# Altium project MiCom.PrjPcb (part 2 of 6)

## Sheet AM3359_B.SchDoc
size A2
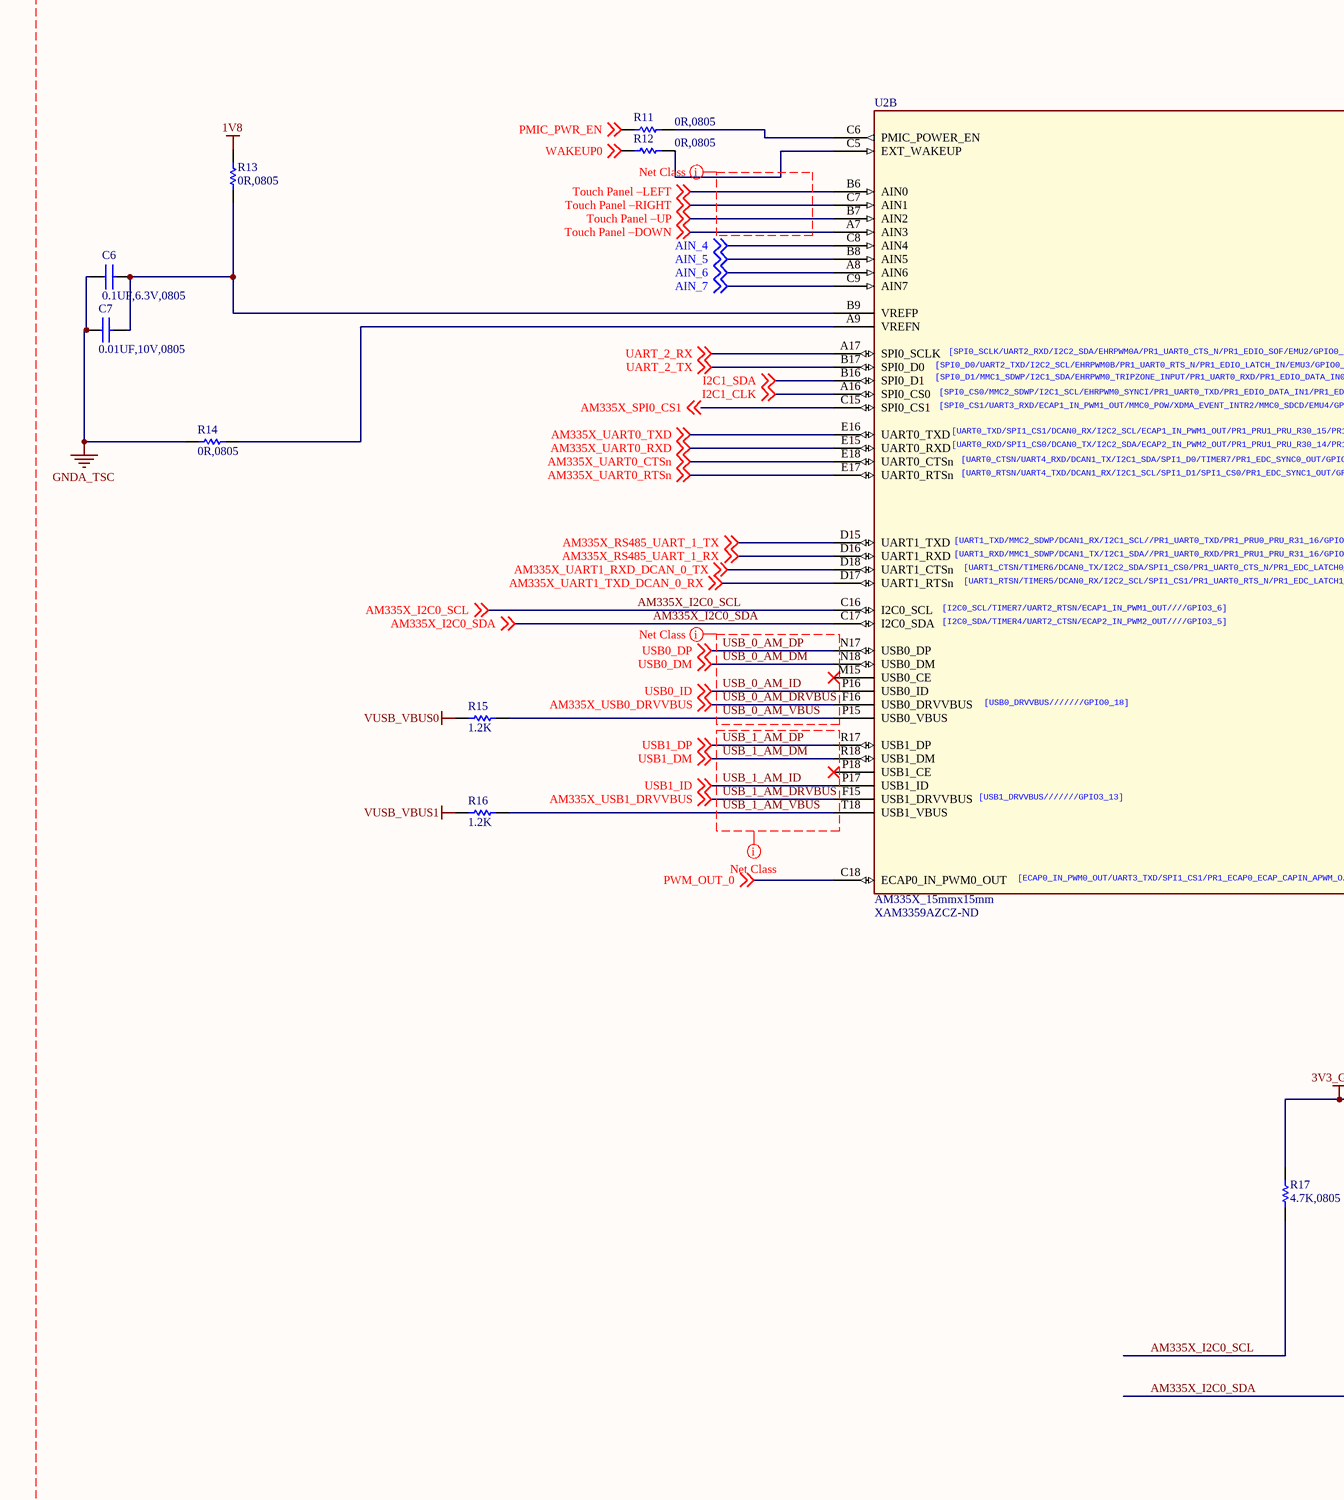
[diagram p2: AM3359_B.SchDoc, left]
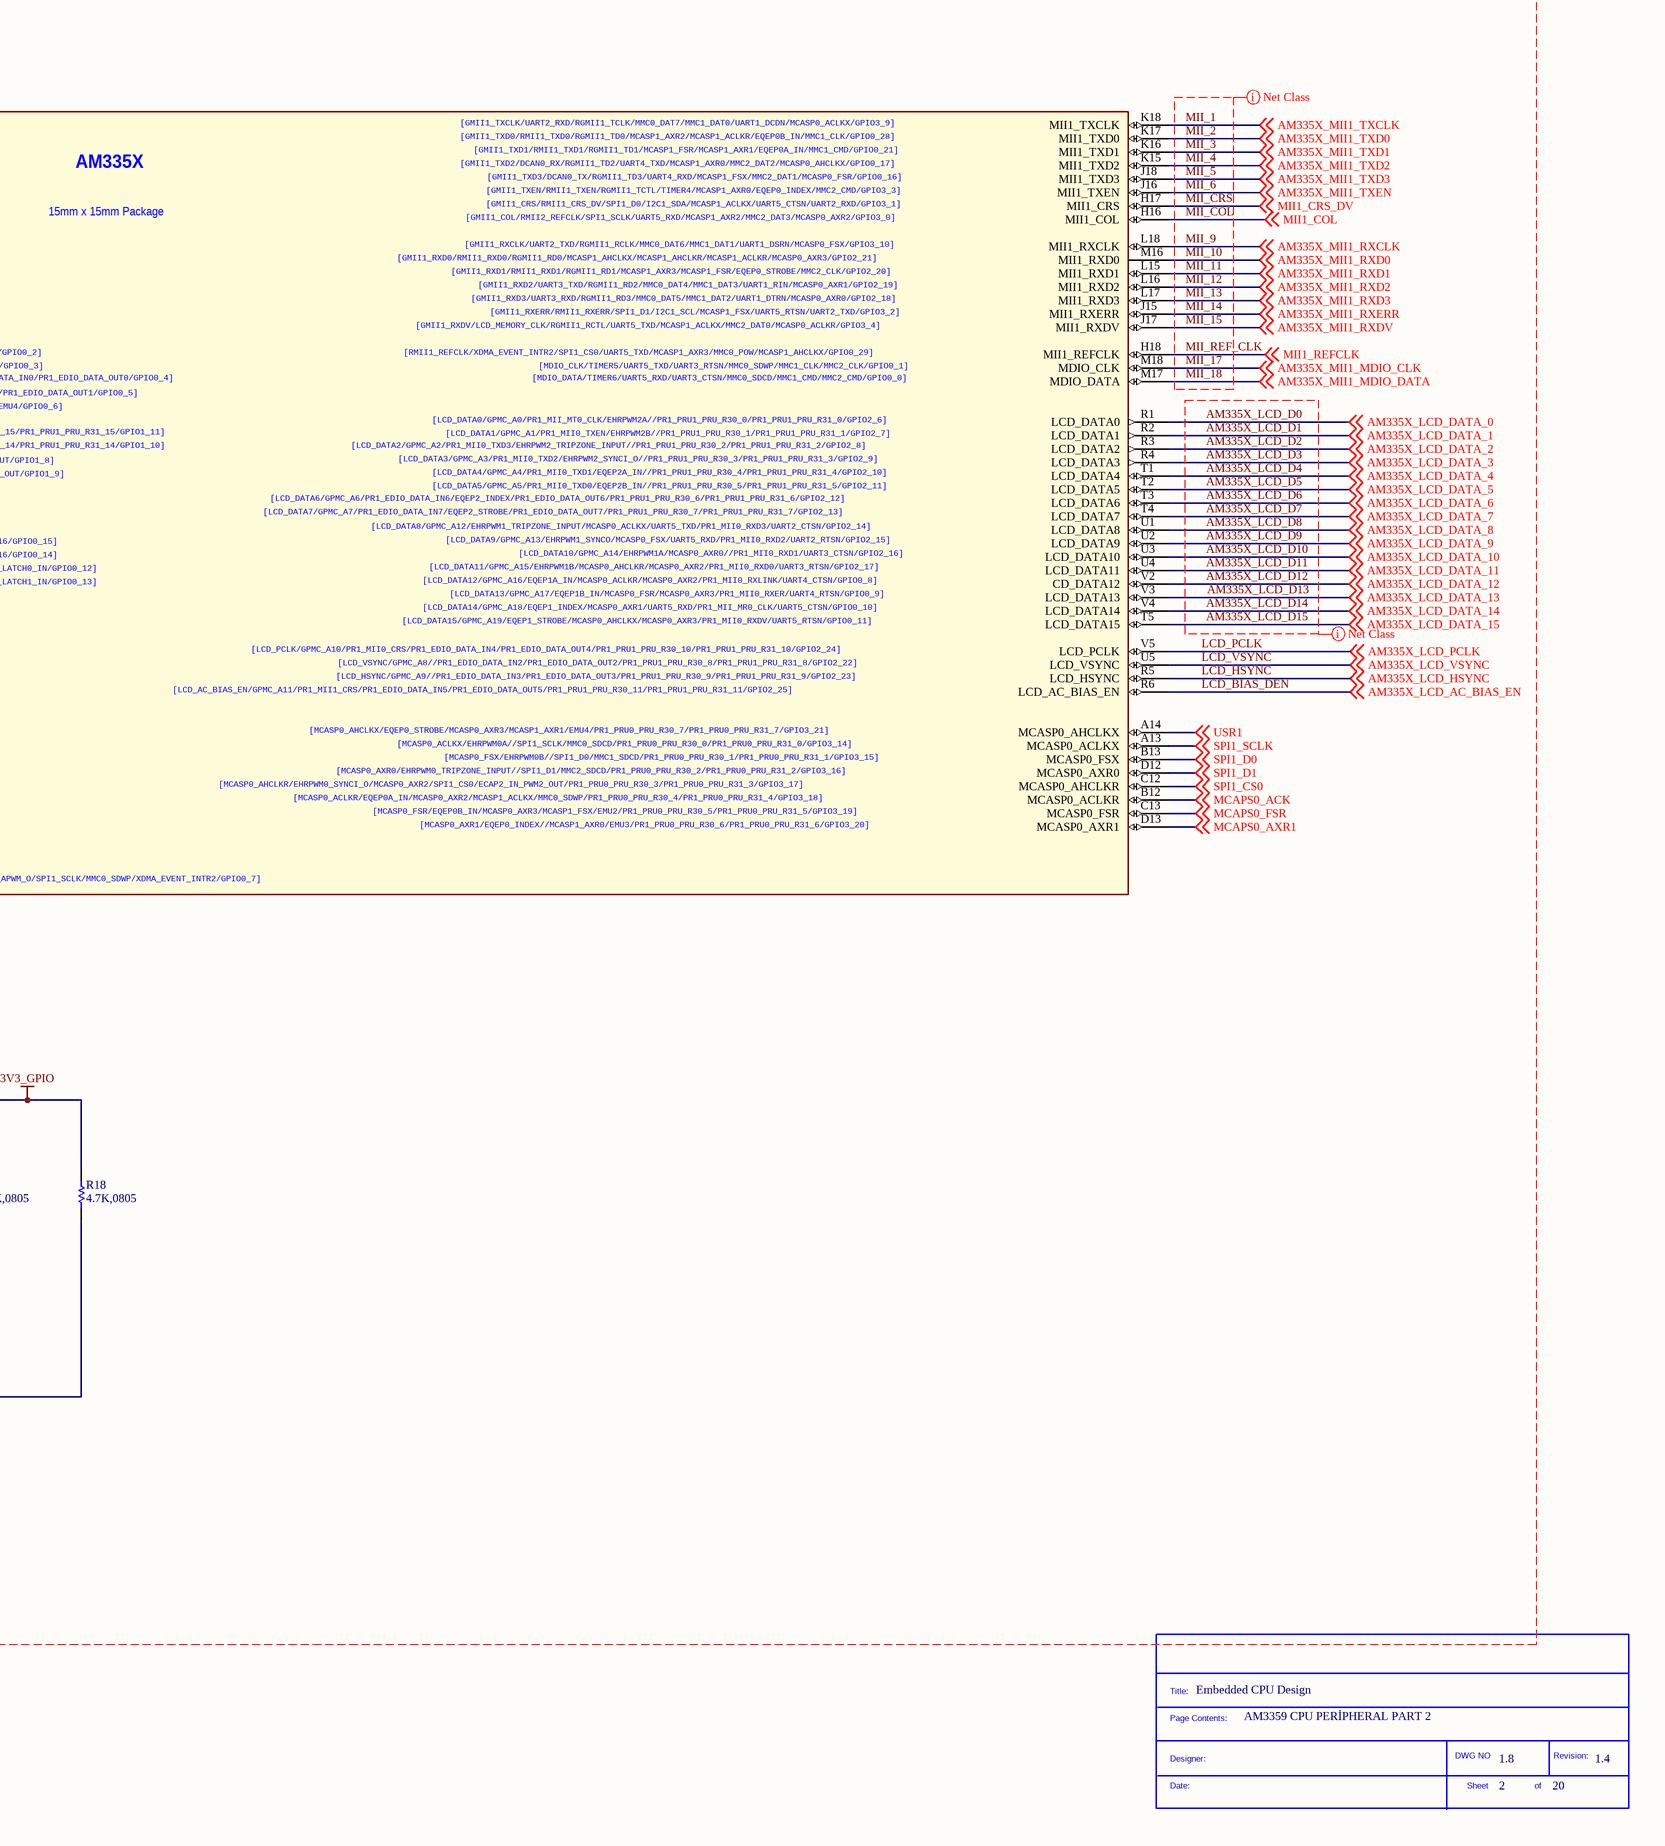
[diagram p3: AM3359_B.SchDoc, right]

### Parts
(Parts that share a designator on the sheet are numbered #1, #2 ... from top to bottom, then left to right.)
*?#2  SDTitleBlock  (value not drawn)  (graphical)
C6  0.1UF,6.3V,0805  [0402]
C7  0.01UF,10V,0805  [0402]
R11  0R,0805  [0402]
R12  0R,0805  [0402]
R13  0R,0805  [0402]
R14  0R,0805  [0402]
R15  1.2K  [0402]
R16  1.2K  [0402]
R17  4.7K,0805  [0402]
R18  4.7K,0805  [0402]
U2  AM335X_15mmx15mm  Supplier Part Number 1: XAM3359AZCZ-ND  [am33xx_15x15]  (part B of 3)

### Nets
1V8: R13.2  [project net 1V8_DM]
3V3_GPIO: R17.2 R18.2  [project net AM335X_VDDSHV1]
GNDA_TSC: C6.1 C7.1 R14.2  [project net GNDA_ADC]
VUSB_VBUS0: R15.1
VUSB_VBUS1: R16.1
AIN_4: U2.C8(AIN4) ; off-sheet AIN_4
AIN_5: U2.B8(AIN5) ; off-sheet AIN_5
AIN_6: U2.A8(AIN6) ; off-sheet AIN_6
AIN_7: U2.C9(AIN7) ; off-sheet AIN_7
AM335X_I2C0_SCL: R17.1 U2.C16(I2C0_SCL) ; off-sheet AM335X_I2C0_SCL
AM335X_I2C0_SDA: R18.1 U2.C17(I2C0_SDA) ; off-sheet AM335X_I2C0_SDA
AM335X_LCD_D0: U2.R1(LCD_DATA0) ; off-sheet AM335X_LCD_DATA_0  [also labelled AM335X_LCD_DATA_0]
AM335X_LCD_D1: U2.R2(LCD_DATA1) ; off-sheet AM335X_LCD_DATA_1  [also labelled AM335X_LCD_DATA_1]
AM335X_LCD_D2: U2.R3(LCD_DATA2) ; off-sheet AM335X_LCD_DATA_2  [also labelled AM335X_LCD_DATA_2]
AM335X_LCD_D3: U2.R4(LCD_DATA3) ; off-sheet AM335X_LCD_DATA_3  [also labelled AM335X_LCD_DATA_3]
AM335X_LCD_D4: U2.T1(LCD_DATA4) ; off-sheet AM335X_LCD_DATA_4  [also labelled AM335X_LCD_DATA_4]
AM335X_LCD_D5: U2.T2(LCD_DATA5) ; off-sheet AM335X_LCD_DATA_5  [also labelled AM335X_LCD_DATA_5]
AM335X_LCD_D6: U2.T3(LCD_DATA6) ; off-sheet AM335X_LCD_DATA_6  [also labelled AM335X_LCD_DATA_6]
AM335X_LCD_D7: U2.T4(LCD_DATA7) ; off-sheet AM335X_LCD_DATA_7  [also labelled AM335X_LCD_DATA_7]
AM335X_LCD_D8: U2.U1(LCD_DATA8) ; off-sheet AM335X_LCD_DATA_8  [also labelled AM335X_LCD_DATA_8]
AM335X_LCD_D9: U2.U2(LCD_DATA9) ; off-sheet AM335X_LCD_DATA_9  [also labelled AM335X_LCD_DATA_9]
AM335X_LCD_D10: U2.U3(LCD_DATA10) ; off-sheet AM335X_LCD_DATA_10  [also labelled AM335X_LCD_DATA_10]
AM335X_LCD_D11: U2.U4(LCD_DATA11) ; off-sheet AM335X_LCD_DATA_11  [also labelled AM335X_LCD_DATA_11]
AM335X_LCD_D12: U2.V2(CD_DATA12) ; off-sheet AM335X_LCD_DATA_12  [also labelled AM335X_LCD_DATA_12]
AM335X_LCD_D13: U2.V3(LCD_DATA13) ; off-sheet AM335X_LCD_DATA_13  [also labelled AM335X_LCD_DATA_13]
AM335X_LCD_D14: U2.V4(LCD_DATA14) ; off-sheet AM335X_LCD_DATA_14  [also labelled AM335X_LCD_DATA_14]
AM335X_LCD_D15: U2.T5(LCD_DATA15) ; off-sheet AM335X_LCD_DATA_15  [also labelled AM335X_LCD_DATA_15]
AM335X_RS485_UART_1_RX: U2.D16(UART1_RXD) ; off-sheet AM335X_RS485_UART_1_RX  [project net RS485_R]
AM335X_RS485_UART_1_TX: U2.D15(UART1_TXD) ; off-sheet AM335X_RS485_UART_1_TX  [project net RS485_D]
AM335X_SPI0_CS1: U2.C15(SPI0_CS1) ; off-sheet AM335X_SPI0_CS1  [project net MMC_CS0]
AM335X_UART0_CTSn: U2.E18(UART0_CTSn) ; off-sheet AM335X_UART0_CTSn
AM335X_UART0_RTSn: U2.E17(UART0_RTSn) ; off-sheet AM335X_UART0_RTSn
AM335X_UART0_RXD: U2.E15(UART0_RXD) ; off-sheet AM335X_UART0_RXD
AM335X_UART0_TXD: U2.E16(UART0_TXD) ; off-sheet AM335X_UART0_TXD
AM335X_UART1_RXD_DCAN_0_TX: U2.D18(UART1_CTSn) ; off-sheet AM335X_UART1_RXD_DCAN_0_TX  [project net CAN1_TXD]
AM335X_UART1_TXD_DCAN_0_RX: U2.D17(UART1_RTSn) ; off-sheet AM335X_UART1_TXD_DCAN_0_RX  [project net CAN1_RXD]
AM335X_USB0_DRVVBUS: U2.F16(USB0_DRVVBUS) ; off-sheet AM335X_USB0_DRVVBUS  [also labelled USB_0_AM_DRVBUS]  [project net USB0_VBUS_EN]
I2C1_CLK: U2.A16(SPI0_CS0) ; off-sheet I2C1_CLK
I2C1_SDA: U2.B16(SPI0_D1) ; off-sheet I2C1_SDA
LCD_BIAS_DEN: U2.R6(LCD_AC_BIAS_EN) ; off-sheet AM335X_LCD_AC_BIAS_EN  [also labelled AM335X_LCD_AC_BIAS_EN]
LCD_HSYNC: U2.R5(LCD_HSYNC) ; off-sheet AM335X_LCD_HSYNC  [also labelled AM335X_LCD_HSYNC]
LCD_PCLK: U2.V5(LCD_PCLK) ; off-sheet AM335X_LCD_PCLK  [also labelled AM335X_LCD_PCLK]
LCD_VSYNC: U2.U5(LCD_VSYNC) ; off-sheet AM335X_LCD_VSYNC  [also labelled AM335X_LCD_VSYNC]
MCAPS0_ACK: U2.B12(MCASP0_ACLKR) ; off-sheet MCAPS0_ACK
MCAPS0_AXR1: U2.D13(MCASP0_AXR1) ; off-sheet MCAPS0_AXR1
MCAPS0_FSR: U2.C13(MCASP0_FSR) ; off-sheet MCAPS0_FSR
MII_1: U2.K18(MII1_TXCLK) ; off-sheet AM335X_MII1_TXCLK  [also labelled AM335X_MII1_TXCLK]
MII_2: U2.K17(MII1_TXD0) ; off-sheet AM335X_MII1_TXD0  [also labelled AM335X_MII1_TXD0]
MII_3: U2.K16(MII1_TXD1) ; off-sheet AM335X_MII1_TXD1  [also labelled AM335X_MII1_TXD1]
MII_4: U2.K15(MII1_TXD2) ; off-sheet AM335X_MII1_TXD2  [also labelled AM335X_MII1_TXD2]
MII_5: U2.J18(MII1_TXD3) ; off-sheet AM335X_MII1_TXD3  [also labelled AM335X_MII1_TXD3]
MII_6: U2.J16(MII1_TXEN) ; off-sheet AM335X_MII1_TXEN  [also labelled AM335X_MII1_TXEN]
MII_9: U2.L18(MII1_RXCLK) ; off-sheet AM335X_MII1_RXCLK  [also labelled AM335X_MII1_RXCLK]
MII_10: U2.M16(MII1_RXD0) ; off-sheet AM335X_MII1_RXD0  [also labelled AM335X_MII1_RXD0]
MII_11: U2.L15(MII1_RXD1) ; off-sheet AM335X_MII1_RXD1  [also labelled AM335X_MII1_RXD1]
MII_12: U2.L16(MII1_RXD2) ; off-sheet AM335X_MII1_RXD2  [also labelled AM335X_MII1_RXD2]
MII_13: U2.L17(MII1_RXD3) ; off-sheet AM335X_MII1_RXD3  [also labelled AM335X_MII1_RXD3]
MII_14: U2.J15(MII1_RXERR) ; off-sheet AM335X_MII1_RXERR  [also labelled AM335X_MII1_RXERR]
MII_15: U2.J17(MII1_RXDV) ; off-sheet AM335X_MII1_RXDV  [also labelled AM335X_MII1_RXDV]
MII_17: U2.M18(MDIO_CLK) ; off-sheet AM335X_MII1_MDIO_CLK  [also labelled AM335X_MII1_MDIO_CLK]
MII_18: U2.M17(MDIO_DATA) ; off-sheet AM335X_MII1_MDIO_DATA  [also labelled AM335X_MII1_MDIO_DATA]
MII_COL: U2.H16(MII1_COL) ; off-sheet MII1_COL  [also labelled MII1_COL]
MII_CRS: U2.H17(MII1_CRS) ; off-sheet MII1_CRS_DV  [also labelled MII1_CRS_DV]
MII_REF_CLK: U2.H18(MII1_REFCLK) ; off-sheet MII1_REFCLK  [also labelled MII1_REFCLK]
PMIC_PWR_EN: R11.1 ; off-sheet PMIC_PWR_EN
PWM_OUT_0: U2.C18(ECAP0_IN_PWM0_OUT) ; off-sheet PWM_OUT_0
SPI1_CS0: U2.C12(MCASP0_AHCLKR) ; off-sheet SPI1_CS0
SPI1_D0: U2.B13(MCASP0_FSX) ; off-sheet SPI1_D0
SPI1_D1: U2.D12(MCASP0_AXR0) ; off-sheet SPI1_D1
SPI1_SCLK: U2.A13(MCASP0_ACLKX) ; off-sheet SPI1_SCLK
Touch Panel –DOWN: U2.A7(AIN3) ; off-sheet Touch Panel –DOWN
Touch Panel –LEFT: U2.B6(AIN0) ; off-sheet Touch Panel –LEFT
Touch Panel –RIGHT: U2.C7(AIN1) ; off-sheet Touch Panel –RIGHT
Touch Panel –UP: U2.B7(AIN2) ; off-sheet Touch Panel –UP
UART_2_RX: U2.A17(SPI0_SCLK) ; off-sheet UART_2_RX
UART_2_TX: U2.B17(SPI0_D0) ; off-sheet UART_2_TX
USB0_ID: U2.P16(USB0_ID) ; off-sheet USB0_ID  [also labelled USB_0_AM_ID]  [project net USB0_ID_0]
USB_0_AM_DM: U2.N18(USB0_DM) ; off-sheet USB0_DM  [also labelled USB0_DM]
USB_0_AM_DP: U2.N17(USB0_DP) ; off-sheet USB0_DP  [also labelled USB0_DP]
USB_0_AM_VBUS: R15.2 U2.P15(USB0_VBUS)
USB_1_AM_DM: U2.R18(USB1_DM) ; off-sheet USB1_DM  [also labelled USB1_DM]
USB_1_AM_DP: U2.R17(USB1_DP) ; off-sheet USB1_DP  [also labelled USB1_DP]
USB_1_AM_DRVBUS: U2.F15(USB1_DRVVBUS) ; off-sheet AM335X_USB1_DRVVBUS  [also labelled AM335X_USB1_DRVVBUS]
USB_1_AM_ID: U2.P17(USB1_ID) ; off-sheet USB1_ID  [also labelled USB1_ID]
USB_1_AM_VBUS: R16.2 U2.T18(USB1_VBUS)
USR1: U2.A14(MCASP0_AHCLKX) ; off-sheet USR1
WAKEUP0: R12.1 ; off-sheet WAKEUP0
NetC6_2: C6.2 C7.2 R13.1 U2.B9(VREFP)
NetR11_2: R11.2 U2.C6(PMIC_POWER_EN)
NetR12_2: R12.2 U2.C5(EXT_WAKEUP)
NetR14_1: R14.1 U2.A9(VREFN)

Not connected (* = marked no-connect by the designer): U2 M15(USB0_CE)* P18(USB1_CE)*

### Layout directives
net class LCD_1: AM335X_LCD_D0, AM335X_LCD_D1, AM335X_LCD_D2, AM335X_LCD_D3, AM335X_LCD_D4, AM335X_LCD_D5, AM335X_LCD_D6, AM335X_LCD_D7, AM335X_LCD_D8, AM335X_LCD_D9, AM335X_LCD_D10, AM335X_LCD_D11, AM335X_LCD_D12, AM335X_LCD_D13, AM335X_LCD_D14, AM335X_LCD_D15
net class MII: MII_1, MII_2, MII_3, MII_4, MII_5, MII_6, MII_9, MII_10, MII_11, MII_12, MII_13, MII_14, MII_15, MII_17, MII_18, MII_COL, MII_CRS, MII_REF_CLK
net class AM335X_B: 1V8, 3V3_GPIO, AIN_4, AIN_5, AIN_6, AIN_7, AM335X_I2C0_SCL, AM335X_I2C0_SDA, AM335X_LCD_AC_BIAS_EN, AM335X_LCD_D0, AM335X_LCD_D1, AM335X_LCD_D2, AM335X_LCD_D3, AM335X_LCD_D4, AM335X_LCD_D5, AM335X_LCD_D6, AM335X_LCD_D7, AM335X_LCD_D8, AM335X_LCD_D9, AM335X_LCD_D10, AM335X_LCD_D11, AM335X_LCD_D12, AM335X_LCD_D13, AM335X_LCD_D14, AM335X_LCD_D15, AM335X_LCD_DATA_0, AM335X_LCD_DATA_1, AM335X_LCD_DATA_2, AM335X_LCD_DATA_3, AM335X_LCD_DATA_4, AM335X_LCD_DATA_5, AM335X_LCD_DATA_6, AM335X_LCD_DATA_7, AM335X_LCD_DATA_8, AM335X_LCD_DATA_9, AM335X_LCD_DATA_10, AM335X_LCD_DATA_11, AM335X_LCD_DATA_12, AM335X_LCD_DATA_13, AM335X_LCD_DATA_14, AM335X_LCD_DATA_15, AM335X_LCD_HSYNC, AM335X_LCD_PCLK, AM335X_LCD_VSYNC, AM335X_MII1_MDIO_CLK, AM335X_MII1_MDIO_DATA, AM335X_MII1_RXCLK, AM335X_MII1_RXD0, AM335X_MII1_RXD1, AM335X_MII1_RXD2, AM335X_MII1_RXD3, AM335X_MII1_RXDV, AM335X_MII1_RXERR, AM335X_MII1_TXCLK, AM335X_MII1_TXD0, AM335X_MII1_TXD1, AM335X_MII1_TXD2, AM335X_MII1_TXD3, AM335X_MII1_TXEN, AM335X_RS485_UART_1_RX, AM335X_RS485_UART_1_TX, AM335X_SPI0_CS1, AM335X_UART0_CTSn, AM335X_UART0_RTSn, AM335X_UART0_RXD, AM335X_UART0_TXD, AM335X_UART1_RXD_DCAN_0_TX, AM335X_UART1_TXD_DCAN_0_RX, AM335X_USB0_DRVVBUS, AM335X_USB1_DRVVBUS, GNDA_TSC, I2C1_CLK, I2C1_SDA, LCD_BIAS_DEN, LCD_HSYNC, LCD_PCLK, LCD_VSYNC, MCAPS0_ACK, MCAPS0_AXR1, MCAPS0_FSR, MII1_COL, MII1_CRS_DV, MII1_REFCLK, MII_1, MII_2, MII_3, MII_4, MII_5, MII_6, MII_9, MII_10, MII_11, MII_12, MII_13, MII_14, MII_15, MII_17, MII_18, MII_COL, MII_CRS, MII_REF_CLK, PMIC_PWR_EN, PWM_OUT_0, SPI1_CS0, SPI1_D0, SPI1_D1, SPI1_SCLK, Touch Panel –DOWN, Touch Panel –LEFT, Touch Panel –RIGHT, Touch Panel –UP, UART_2_RX, UART_2_TX, USB0_DM, USB0_DP, USB0_ID, USB1_DM, USB1_DP, USB1_ID, USB_0_AM_DM, USB_0_AM_DP, USB_0_AM_DRVBUS, USB_0_AM_ID, USB_0_AM_VBUS, USB_1_AM_DM, USB_1_AM_DP, USB_1_AM_DRVBUS, USB_1_AM_ID, USB_1_AM_VBUS, USR1, VUSB_VBUS0, VUSB_VBUS1, WAKEUP0
net class USB_0_AMX: 1V8, 3V3_GPIO, AIN_4, AIN_5, AIN_6, AIN_7, AM335X_I2C0_SCL, AM335X_I2C0_SDA, AM335X_LCD_AC_BIAS_EN, AM335X_LCD_D0, AM335X_LCD_D1, AM335X_LCD_D2, AM335X_LCD_D3, AM335X_LCD_D4, AM335X_LCD_D5, AM335X_LCD_D6, AM335X_LCD_D7, AM335X_LCD_D8, AM335X_LCD_D9, AM335X_LCD_D10, AM335X_LCD_D11, AM335X_LCD_D12, AM335X_LCD_D13, AM335X_LCD_D14, AM335X_LCD_D15, AM335X_LCD_DATA_0, AM335X_LCD_DATA_1, AM335X_LCD_DATA_2, AM335X_LCD_DATA_3, AM335X_LCD_DATA_4, AM335X_LCD_DATA_5, AM335X_LCD_DATA_6, AM335X_LCD_DATA_7, AM335X_LCD_DATA_8, AM335X_LCD_DATA_9, AM335X_LCD_DATA_10, AM335X_LCD_DATA_11, AM335X_LCD_DATA_12, AM335X_LCD_DATA_13, AM335X_LCD_DATA_14, AM335X_LCD_DATA_15, AM335X_LCD_HSYNC, AM335X_LCD_PCLK, AM335X_LCD_VSYNC, AM335X_MII1_MDIO_CLK, AM335X_MII1_MDIO_DATA, AM335X_MII1_RXCLK, AM335X_MII1_RXD0, AM335X_MII1_RXD1, AM335X_MII1_RXD2, AM335X_MII1_RXD3, AM335X_MII1_RXDV, AM335X_MII1_RXERR, AM335X_MII1_TXCLK, AM335X_MII1_TXD0, AM335X_MII1_TXD1, AM335X_MII1_TXD2, AM335X_MII1_TXD3, AM335X_MII1_TXEN, AM335X_RS485_UART_1_RX, AM335X_RS485_UART_1_TX, AM335X_SPI0_CS1, AM335X_UART0_CTSn, AM335X_UART0_RTSn, AM335X_UART0_RXD, AM335X_UART0_TXD, AM335X_UART1_RXD_DCAN_0_TX, AM335X_UART1_TXD_DCAN_0_RX, AM335X_USB0_DRVVBUS, AM335X_USB1_DRVVBUS, GNDA_TSC, I2C1_CLK, I2C1_SDA, LCD_BIAS_DEN, LCD_HSYNC, LCD_PCLK, LCD_VSYNC, MCAPS0_ACK, MCAPS0_AXR1, MCAPS0_FSR, MII1_COL, MII1_CRS_DV, MII1_REFCLK, MII_1, MII_2, MII_3, MII_4, MII_5, MII_6, MII_9, MII_10, MII_11, MII_12, MII_13, MII_14, MII_15, MII_17, MII_18, MII_COL, MII_CRS, MII_REF_CLK, PMIC_PWR_EN, PWM_OUT_0, SPI1_CS0, SPI1_D0, SPI1_D1, SPI1_SCLK, Touch Panel –DOWN, Touch Panel –LEFT, Touch Panel –RIGHT, Touch Panel –UP, UART_2_RX, UART_2_TX, USB0_DM, USB0_DP, USB0_ID, USB1_DM, USB1_DP, USB1_ID, USB_0_AM_DM, USB_0_AM_DP, USB_0_AM_DRVBUS, USB_0_AM_ID, USB_0_AM_VBUS, USB_1_AM_DM, USB_1_AM_DP, USB_1_AM_DRVBUS, USB_1_AM_ID, USB_1_AM_VBUS, USR1, VUSB_VBUS0, VUSB_VBUS1, WAKEUP0
net class USB_1_AMX: 1V8, 3V3_GPIO, AIN_4, AIN_5, AIN_6, AIN_7, AM335X_I2C0_SCL, AM335X_I2C0_SDA, AM335X_LCD_AC_BIAS_EN, AM335X_LCD_D0, AM335X_LCD_D1, AM335X_LCD_D2, AM335X_LCD_D3, AM335X_LCD_D4, AM335X_LCD_D5, AM335X_LCD_D6, AM335X_LCD_D7, AM335X_LCD_D8, AM335X_LCD_D9, AM335X_LCD_D10, AM335X_LCD_D11, AM335X_LCD_D12, AM335X_LCD_D13, AM335X_LCD_D14, AM335X_LCD_D15, AM335X_LCD_DATA_0, AM335X_LCD_DATA_1, AM335X_LCD_DATA_2, AM335X_LCD_DATA_3, AM335X_LCD_DATA_4, AM335X_LCD_DATA_5, AM335X_LCD_DATA_6, AM335X_LCD_DATA_7, AM335X_LCD_DATA_8, AM335X_LCD_DATA_9, AM335X_LCD_DATA_10, AM335X_LCD_DATA_11, AM335X_LCD_DATA_12, AM335X_LCD_DATA_13, AM335X_LCD_DATA_14, AM335X_LCD_DATA_15, AM335X_LCD_HSYNC, AM335X_LCD_PCLK, AM335X_LCD_VSYNC, AM335X_MII1_MDIO_CLK, AM335X_MII1_MDIO_DATA, AM335X_MII1_RXCLK, AM335X_MII1_RXD0, AM335X_MII1_RXD1, AM335X_MII1_RXD2, AM335X_MII1_RXD3, AM335X_MII1_RXDV, AM335X_MII1_RXERR, AM335X_MII1_TXCLK, AM335X_MII1_TXD0, AM335X_MII1_TXD1, AM335X_MII1_TXD2, AM335X_MII1_TXD3, AM335X_MII1_TXEN, AM335X_RS485_UART_1_RX, AM335X_RS485_UART_1_TX, AM335X_SPI0_CS1, AM335X_UART0_CTSn, AM335X_UART0_RTSn, AM335X_UART0_RXD, AM335X_UART0_TXD, AM335X_UART1_RXD_DCAN_0_TX, AM335X_UART1_TXD_DCAN_0_RX, AM335X_USB0_DRVVBUS, AM335X_USB1_DRVVBUS, GNDA_TSC, I2C1_CLK, I2C1_SDA, LCD_BIAS_DEN, LCD_HSYNC, LCD_PCLK, LCD_VSYNC, MCAPS0_ACK, MCAPS0_AXR1, MCAPS0_FSR, MII1_COL, MII1_CRS_DV, MII1_REFCLK, MII_1, MII_2, MII_3, MII_4, MII_5, MII_6, MII_9, MII_10, MII_11, MII_12, MII_13, MII_14, MII_15, MII_17, MII_18, MII_COL, MII_CRS, MII_REF_CLK, PMIC_PWR_EN, PWM_OUT_0, SPI1_CS0, SPI1_D0, SPI1_D1, SPI1_SCLK, Touch Panel –DOWN, Touch Panel –LEFT, Touch Panel –RIGHT, Touch Panel –UP, UART_2_RX, UART_2_TX, USB0_DM, USB0_DP, USB0_ID, USB1_DM, USB1_DP, USB1_ID, USB_0_AM_DM, USB_0_AM_DP, USB_0_AM_DRVBUS, USB_0_AM_ID, USB_0_AM_VBUS, USB_1_AM_DM, USB_1_AM_DP, USB_1_AM_DRVBUS, USB_1_AM_ID, USB_1_AM_VBUS, USR1, VUSB_VBUS0, VUSB_VBUS1, WAKEUP0
net class TOUCH: 1V8, 3V3_GPIO, AIN_4, AIN_5, AIN_6, AIN_7, AM335X_I2C0_SCL, AM335X_I2C0_SDA, AM335X_LCD_AC_BIAS_EN, AM335X_LCD_D0, AM335X_LCD_D1, AM335X_LCD_D2, AM335X_LCD_D3, AM335X_LCD_D4, AM335X_LCD_D5, AM335X_LCD_D6, AM335X_LCD_D7, AM335X_LCD_D8, AM335X_LCD_D9, AM335X_LCD_D10, AM335X_LCD_D11, AM335X_LCD_D12, AM335X_LCD_D13, AM335X_LCD_D14, AM335X_LCD_D15, AM335X_LCD_DATA_0, AM335X_LCD_DATA_1, AM335X_LCD_DATA_2, AM335X_LCD_DATA_3, AM335X_LCD_DATA_4, AM335X_LCD_DATA_5, AM335X_LCD_DATA_6, AM335X_LCD_DATA_7, AM335X_LCD_DATA_8, AM335X_LCD_DATA_9, AM335X_LCD_DATA_10, AM335X_LCD_DATA_11, AM335X_LCD_DATA_12, AM335X_LCD_DATA_13, AM335X_LCD_DATA_14, AM335X_LCD_DATA_15, AM335X_LCD_HSYNC, AM335X_LCD_PCLK, AM335X_LCD_VSYNC, AM335X_MII1_MDIO_CLK, AM335X_MII1_MDIO_DATA, AM335X_MII1_RXCLK, AM335X_MII1_RXD0, AM335X_MII1_RXD1, AM335X_MII1_RXD2, AM335X_MII1_RXD3, AM335X_MII1_RXDV, AM335X_MII1_RXERR, AM335X_MII1_TXCLK, AM335X_MII1_TXD0, AM335X_MII1_TXD1, AM335X_MII1_TXD2, AM335X_MII1_TXD3, AM335X_MII1_TXEN, AM335X_RS485_UART_1_RX, AM335X_RS485_UART_1_TX, AM335X_SPI0_CS1, AM335X_UART0_CTSn, AM335X_UART0_RTSn, AM335X_UART0_RXD, AM335X_UART0_TXD, AM335X_UART1_RXD_DCAN_0_TX, AM335X_UART1_TXD_DCAN_0_RX, AM335X_USB0_DRVVBUS, AM335X_USB1_DRVVBUS, GNDA_TSC, I2C1_CLK, I2C1_SDA, LCD_BIAS_DEN, LCD_HSYNC, LCD_PCLK, LCD_VSYNC, MCAPS0_ACK, MCAPS0_AXR1, MCAPS0_FSR, MII1_COL, MII1_CRS_DV, MII1_REFCLK, MII_1, MII_2, MII_3, MII_4, MII_5, MII_6, MII_9, MII_10, MII_11, MII_12, MII_13, MII_14, MII_15, MII_17, MII_18, MII_COL, MII_CRS, MII_REF_CLK, PMIC_PWR_EN, PWM_OUT_0, SPI1_CS0, SPI1_D0, SPI1_D1, SPI1_SCLK, Touch Panel –DOWN, Touch Panel –LEFT, Touch Panel –RIGHT, Touch Panel –UP, UART_2_RX, UART_2_TX, USB0_DM, USB0_DP, USB0_ID, USB1_DM, USB1_DP, USB1_ID, USB_0_AM_DM, USB_0_AM_DP, USB_0_AM_DRVBUS, USB_0_AM_ID, USB_0_AM_VBUS, USB_1_AM_DM, USB_1_AM_DP, USB_1_AM_DRVBUS, USB_1_AM_ID, USB_1_AM_VBUS, USR1, VUSB_VBUS0, VUSB_VBUS1, WAKEUP0

### Notes on the sheet
- Embedded CPU Design
- AM3359 CPU PERİPHERAL PART 2
- 2
- 1.8
- 20
- 1.4
- (in symbol AM335X_15mmx15mm, part B) [GMII1_TXCLK/UART2_RXD/RGMII1_TCLK/MMC0_DAT7/MMC1_DAT0/UART1_DCDN/MCASP0_ACLKX/GPIO3_9]; [GMII1_TXD0/RMII1_TXD0/RGMII1_TD0/MCASP1_AXR2/MCASP1_ACLKR/EQEP0B_IN/MMC1_CLK/GPIO0_28]; [GMII1_TXD1/RMII1_TXD1/RGMII1_TD1/MCASP1_FSR/MCASP1_AXR1/EQEP0A_IN/MMC1_CMD/GPIO0_21]; AM335X; [GMII1_TXD2/DCAN0_RX/RGMII1_TD2/UART4_TXD/MCASP1_AXR0/MMC2_DAT2/MCASP0_AHCLKX/GPIO0_17]; [GMII1_TXD3/DCAN0_TX/RGMII1_TD3/UART4_RXD/MCASP1_FSX/MMC2_DAT1/MCASP0_FSR/GPIO0_16]; [GMII1_TXEN/RMII1_TXEN/RGMII1_TCTL/TIMER4/MCASP1_AXR0/EQEP0_INDEX/MMC2_CMD/GPIO3_3]; [GMII1_CRS/RMII1_CRS_DV/SPI1_D0/I2C1_SDA/MCASP1_ACLKX/UART5_CTSN/UART2_RXD/GPIO3_1]; 15mm x 15mm Package; [GMII1_COL/RMII2_REFCLK/SPI1_SCLK/UART5_RXD/MCASP1_AXR2/MMC2_DAT3/MCASP0_AXR2/GPIO3_0]; [GMII1_RXCLK/UART2_TXD/RGMII1_RCLK/MMC0_DAT6/MMC1_DAT1/UART1_DSRN/MCASP0_FSX/GPIO3_10]; [GMII1_RXD0/RMII1_RXD0/RGMII1_RD0/MCASP1_AHCLKX/MCASP1_AHCLKR/MCASP1_ACLKR/MCASP0_AXR3/GPIO2_21]; [GMII1_RXD1/RMII1_RXD1/RGMII1_RD1/MCASP1_AXR3/MCASP1_FSR/EQEP0_STROBE/MMC2_CLK/GPIO2_20]; [GMII1_RXD2/UART3_TXD/RGMII1_RD2/MMC0_DAT4/MMC1_DAT3/UART1_RIN/MCASP0_AXR1/GPIO2_19]; [GMII1_RXD3/UART3_RXD/RGMII1_RD3/MMC0_DAT5/MMC1_DAT2/UART1_DTRN/MCASP0_AXR0/GPIO2_18]; [GMII1_RXERR/RMII1_RXERR/SPI1_D1/I2C1_SCL/MCASP1_FSX/UART5_RTSN/UART2_TXD/GPIO3_2]; [GMII1_RXDV/LCD_MEMORY_CLK/RGMII1_RCTL/UART5_TXD/MCASP1_ACLKX/MMC2_DAT0/MCASP0_ACLKR/GPIO3_4]; [SPI0_SCLK/UART2_RXD/I2C2_SDA/EHRPWM0A/PR1_UART0_CTS_N/PR1_EDIO_SOF/EMU2/GPIO0_2]; [RMII1_REFCLK/XDMA_EVENT_INTR2/SPI1_CS0/UART5_TXD/MCASP1_AXR3/MMC0_POW/MCASP1_AHCLKX/GPIO0_29]; [SPI0_D0/UART2_TXD/I2C2_SCL/EHRPWM0B/PR1_UART0_RTS_N/PR1_EDIO_LATCH_IN/EMU3/GPIO0_3]; [MDIO_CLK/TIMER5/UART5_TXD/UART3_RTSN/MMC0_SDWP/MMC1_CLK/MMC2_CLK/GPIO0_1]; [SPI0_D1/MMC1_SDWP/I2C1_SDA/EHRPWM0_TRIPZONE_INPUT/PR1_UART0_RXD/PR1_EDIO_DATA_IN0/PR1_EDIO_DATA_OUT0/GPIO0_4]; [MDIO_DATA/TIMER6/UART5_RXD/UART3_CTSN/MMC0_SDCD/MMC1_CMD/MMC2_CMD/GPIO0_0]; [SPI0_CS0/MMC2_SDWP/I2C1_SCL/EHRPWM0_SYNCI/PR1_UART0_TXD/PR1_EDIO_DATA_IN1/PR1_EDIO_DATA_OUT1/GPIO0_5]; [SPI0_CS1/UART3_RXD/ECAP1_IN_PWM1_OUT/MMC0_POW/XDMA_EVENT_INTR2/MMC0_SDCD/EMU4/GPIO0_6]; [LCD_DATA0/GPMC_A0/PR1_MII_MT0_CLK/EHRPWM2A//PR1_PRU1_PRU_R30_0/PR1_PRU1_PRU_R31_0/GPIO2_6]; [UART0_TXD/SPI1_CS1/DCAN0_RX/I2C2_SCL/ECAP1_IN_PWM1_OUT/PR1_PRU1_PRU_R30_15/PR1_PRU1_PRU_R31_15/GPIO1_11]; [LCD_DATA1/GPMC_A1/PR1_MII0_TXEN/EHRPWM2B//PR1_PRU1_PRU_R30_1/PR1_PRU1_PRU_R31_1/GPIO2_7]; [UART0_RXD/SPI1_CS0/DCAN0_TX/I2C2_SDA/ECAP2_IN_PWM2_OUT/PR1_PRU1_PRU_R30_14/PR1_PRU1_PRU_R31_14/GPIO1_10]; [LCD_DATA2/GPMC_A2/PR1_MII0_TXD3/EHRPWM2_TRIPZONE_INPUT//PR1_PRU1_PRU_R30_2/PR1_PRU1_PRU_R31_2/GPIO2_8]; [LCD_DATA3/GPMC_A3/PR1_MII0_TXD2/EHRPWM2_SYNCI_O//PR1_PRU1_PRU_R30_3/PR1_PRU1_PRU_R31_3/GPIO2_9]; [UART0_CTSN/UART4_RXD/DCAN1_TX/I2C1_SDA/SPI1_D0/TIMER7/PR1_EDC_SYNC0_OUT/GPIO1_8]; [LCD_DATA4/GPMC_A4/PR1_MII0_TXD1/EQEP2A_IN//PR1_PRU1_PRU_R30_4/PR1_PRU1_PRU_R31_4/GPIO2_10]; [UART0_RTSN/UART4_TXD/DCAN1_RX/I2C1_SCL/SPI1_D1/SPI1_CS0/PR1_EDC_SYNC1_OUT/GPIO1_9]; [LCD_DATA5/GPMC_A5/PR1_MII0_TXD0/EQEP2B_IN//PR1_PRU1_PRU_R30_5/PR1_PRU1_PRU_R31_5/GPIO2_11]; [LCD_DATA6/GPMC_A6/PR1_EDIO_DATA_IN6/EQEP2_INDEX/PR1_EDIO_DATA_OUT6/PR1_PRU1_PRU_R30_6/PR1_PRU1_PRU_R31_6/GPIO2_12]; [LCD_DATA7/GPMC_A7/PR1_EDIO_DATA_IN7/EQEP2_STROBE/PR1_EDIO_DATA_OUT7/PR1_PRU1_PRU_R30_7/PR1_PRU1_PRU_R31_7/GPIO2_13]; [LCD_DATA8/GPMC_A12/EHRPWM1_TRIPZONE_INPUT/MCASP0_ACLKX/UART5_TXD/PR1_MII0_RXD3/UART2_CTSN/GPIO2_14]; [LCD_DATA9/GPMC_A13/EHRPWM1_SYNCO/MCASP0_FSX/UART5_RXD/PR1_MII0_RXD2/UART2_RTSN/GPIO2_15]; [UART1_TXD/MMC2_SDWP/DCAN1_RX/I2C1_SCL//PR1_UART0_TXD/PR1_PRU0_PRU_R31_16/GPIO0_15]; [LCD_DATA10/GPMC_A14/EHRPWM1A/MCASP0_AXR0//PR1_MII0_RXD1/UART3_CTSN/GPIO2_16]; [UART1_RXD/MMC1_SDWP/DCAN1_TX/I2C1_SDA//PR1_UART0_RXD/PR1_PRU1_PRU_R31_16/GPIO0_14]; [LCD_DATA11/GPMC_A15/EHRPWM1B/MCASP0_AHCLKR/MCASP0_AXR2/PR1_MII0_RXD0/UART3_RTSN/GPIO2_17]; [UART1_CTSN/TIMER6/DCAN0_TX/I2C2_SDA/SPI1_CS0/PR1_UART0_CTS_N/PR1_EDC_LATCH0_IN/GPIO0_12]; [LCD_DATA12/GPMC_A16/EQEP1A_IN/MCASP0_ACLKR/MCASP0_AXR2/PR1_MII0_RXLINK/UART4_CTSN/GPIO0_8]; [UART1_RTSN/TIMER5/DCAN0_RX/I2C2_SCL/SPI1_CS1/PR1_UART0_RTS_N/PR1_EDC_LATCH1_IN/GPIO0_13]; [LCD_DATA13/GPMC_A17/EQEP1B_IN/MCASP0_FSR/MCASP0_AXR3/PR1_MII0_RXER/UART4_RTSN/GPIO0_9]; [LCD_DATA14/GPMC_A18/EQEP1_INDEX/MCASP0_AXR1/UART5_RXD/PR1_MII_MR0_CLK/UART5_CTSN/GPIO0_10]; [I2C0_SCL/TIMER7/UART2_RTSN/ECAP1_IN_PWM1_OUT////GPIO3_6]; [LCD_DATA15/GPMC_A19/EQEP1_STROBE/MCASP0_AHCLKX/MCASP0_AXR3/PR1_MII0_RXDV/UART5_RTSN/GPIO0_11]; [I2C0_SDA/TIMER4/UART2_CTSN/ECAP2_IN_PWM2_OUT////GPIO3_5]; [LCD_PCLK/GPMC_A10/PR1_MII0_CRS/PR1_EDIO_DATA_IN4/PR1_EDIO_DATA_OUT4/PR1_PRU1_PRU_R30_10/PR1_PRU1_PRU_R31_10/GPIO2_24]; [LCD_VSYNC/GPMC_A8//PR1_EDIO_DATA_IN2/PR1_EDIO_DATA_OUT2/PR1_PRU1_PRU_R30_8/PR1_PRU1_PRU_R31_8/GPIO2_22]; [LCD_HSYNC/GPMC_A9//PR1_EDIO_DATA_IN3/PR1_EDIO_DATA_OUT3/PR1_PRU1_PRU_R30_9/PR1_PRU1_PRU_R31_9/GPIO2_23]; [LCD_AC_BIAS_EN/GPMC_A11/PR1_MII1_CRS/PR1_EDIO_DATA_IN5/PR1_EDIO_DATA_OUT5/PR1_PRU1_PRU_R30_11/PR1_PRU1_PRU_R31_11/GPIO2_25]; [USB0_DRVVBUS///////GPIO0_18]; [MCASP0_AHCLKX/EQEP0_STROBE/MCASP0_AXR3/MCASP1_AXR1/EMU4/PR1_PRU0_PRU_R30_7/PR1_PRU0_PRU_R31_7/GPIO3_21]; [MCASP0_ACLKX/EHRPWM0A//SPI1_SCLK/MMC0_SDCD/PR1_PRU0_PRU_R30_0/PR1_PRU0_PRU_R31_0/GPIO3_14]; [MCASP0_FSX/EHRPWM0B//SPI1_D0/MMC1_SDCD/PR1_PRU0_PRU_R30_1/PR1_PRU0_PRU_R31_1/GPIO3_15]; [MCASP0_AXR0/EHRPWM0_TRIPZONE_INPUT//SPI1_D1/MMC2_SDCD/PR1_PRU0_PRU_R30_2/PR1_PRU0_PRU_R31_2/GPIO3_16]; [MCASP0_AHCLKR/EHRPWM0_SYNCI_O/MCASP0_AXR2/SPI1_CS0/ECAP2_IN_PWM2_OUT/PR1_PRU0_PRU_R30_3/PR1_PRU0_PRU_R31_3/GPIO3_17]; [USB1_DRVVBUS///////GPIO3_13]; [MCASP0_ACLKR/EQEP0A_IN/MCASP0_AXR2/MCASP1_ACLKX/MMC0_SDWP/PR1_PRU0_PRU_R30_4/PR1_PRU0_PRU_R31_4/GPIO3_18]; [MCASP0_FSR/EQEP0B_IN/MCASP0_AXR3/MCASP1_FSX/EMU2/PR1_PRU0_PRU_R30_5/PR1_PRU0_PRU_R31_5/GPIO3_19]; [MCASP0_AXR1/EQEP0_INDEX//MCASP1_AXR0/EMU3/PR1_PRU0_PRU_R30_6/PR1_PRU0_PRU_R31_6/GPIO3_20]; [ECAP0_IN_PWM0_OUT/UART3_TXD/SPI1_CS1/PR1_ECAP0_ECAP_CAPIN_APWM_O/SPI1_SCLK/MMC0_SDWP/XDMA_EVENT_INTR2/GPIO0_7]
- (in symbol SDTitleBlock) Title:; Page Contents:; Designer:; DWG NO; Revision:; Date:; Sheet; of

### Library data of the parts
C6 = 0.1UF,6.3V,0805: CAP CER 0.1UF 6.3V 10% X7R 0805; Manufacturer: Kemet; Manufacturer Part Number: C0805C104K9RACTU; Capacitance: 0.1µF; Supplier 1: Digi-Key; RoHS: RoHS Compliant; Category: Capacitors; Stock 1: 19204; Pricing 1: 1=0.12, 10=0.083, 25=0.062, 50=0.0476, 100=0.0392, 250=0.03304, 1000=0.02228 (USD); Packaging: Digi-Reel®; Tolerance: ±10%; Voltage - Rated: 6.3V; Temperature Coefficient: X7R; Mounting Type: Surface Mount, MLCC; Operating Temperature: -55°C ~ 125°C; Applications: General Purpose; Ratings: -; Package / Case: 0805 (2012 Metric); Size / Dimension: 0.079" L x 0.049" W (2.00mm x 1.25mm); Height - Seated (Max): -; Thickness (Max): 0.035" (0.88mm); Lead Spacing: -; Features: -; Lead Style: -; ComponentLink1URL: http://www.kemet.com/docfinder?Partnumber=C0805C104K9RACTU; ComponentLink1Description: http://www.kemet.com/docfinder?Partnumber=C0805C104K9RACTU; Supplier Part Number 1: 399-9155-6-ND
C7 = 0.01UF,10V,0805: MULTICOMP - MCSH21B103K100CT - CAP, MLCC, X7R, 10NF, 10V, 0805; Capacitance: 10000pF; Tolerance: ±10%; Voltage - Rated: 16V; Supplier 1: Digi-Key; Manufacturer: MULTICOMP; Manufacturer Part Number: MCSH21B103K100CT; RoHS: YES; Stock 1: 21284; Pricing 1: 1=0.24, 10=0.2, 50=0.1126, 100=0.1, 250=0.075, 500=0.06626, 1000=0.05875 (USD); ComponentLink1URL: http://www.farnell.com/datasheets/1825494.pdf; ComponentLink1Description: http://www.farnell.com/datasheets/1825494.pdf; Supplier Part Number 1: 399-7995-1-ND; Category: Capacitors; Packaging: Cut Tape (CT); Temperature Coefficient: X7R; Mounting Type: Surface Mount, MLCC; Operating Temperature: -55°C ~ 125°C; Applications: General Purpose; Ratings: -; Package / Case: 0805 (2012 Metric); Size / Dimension: 0.079" L x 0.049" W (2.00mm x 1.25mm); Height - Seated (Max): -; Thickness (Max): 0.035" (0.88mm); Lead Spacing: -; Features: -; Lead Style: -; ComponentLink2URL: http://www.kemet.com/docfinder?Partnumber=C0805C103K4RACTU; ComponentLink2Description: http://www.kemet.com/docfinder?Partnumber=C0805C103K4RACTU
R11-R14 = 0R,0805: as R1 on sheet AM3359_A; Manufacturer: BOURNS; Manufacturer Part Number: CR0805-J/-000ELF; RoHS: YES; Resistance Tolerance: ± 5%; Packaging: Cut Tape; MSL: MSL 1 - Unlimited; ComponentLink1URL: http://www.farnell.com/datasheets/1845293.pdf; ComponentLink1Description: http://www.farnell.com/datasheets/1845293.pdf; Category: Connectors, Interconnects; Number of Rows: 1; Applications: 10/100 Base-T, AutoMDIX; Mounting Type: Through Hole; Orientation: 90° Angle (Right); Termination: Solder; Height Above Board: 0.555" (14.10mm); Features: Board Lock, Decoupling Capacitance; Contact Material: Phosphor Bronze; Contact Finish: Gold; Contact Finish Thickness: 50µin (1.27µm); Housing Material: Polyethylene Terephthalate (PET), Polyester; Operating Temperature: 0°C ~ 70°C; ComponentLink2URL: http://www.trpconnector.com/pdfs/6605728.pdf; ComponentLink2Description: http://www.trpconnector.com/pdfs/6605728.pdf; Supplier 1: Digi-Key; Stock 1: 1539206; Pricing 1: 1=0.1, 50=0.0196, 100=0.0149, 250=0.01104, 500=0.00816, 1000=0.00544, 2500=0.00459 (USD); Composition: Thick Film; Package / Case: 0805 (2012 Metric); Supplier Device Package: 0805; Size / Dimension: 0.079" L x 0.049" W (2.00mm x 1.25mm); Height: 0.028" (0.70mm); Number of Terminations: 2; ComponentLink3URL: http://industrial.panasonic.com/www-cgi/jvcr13pz.cgi?E+PZ+3+AOA0001+ERJ6GEY0R00V+7+WW; ComponentLink3Description: http://industrial.panasonic.com/www-cgi/jvcr13pz.cgi?E+PZ+3+AOA0001+ERJ6GEY0R00V+7+WW; Supplier Part Number 1: P0.0ACT-ND
R15 R16 = 1.2K: MULTICOMP - MCPWR05FTEW1201 - RESISTOR, 0805, 1.2K 1%,  0.125W; Tolerance: ±5%; Power (Watts): 0.125W, 1/8W; Temperature Coefficient: ±200ppm/°C; Manufacturer: MULTICOMP; Manufacturer Part Number: MCPWR05FTEW1201; RoHS: Y-EX; ComponentLink1URL: http://www.farnell.com/datasheets/1718729.pdf; ComponentLink1Description: http://www.farnell.com/datasheets/1718729.pdf; ComponentLink2URL: http://www.farnell.com/cad/1559081.zip; ComponentLink2Description: http://www.farnell.com/cad/1559081.zip; Supplier 1: Digi-Key; Category: Resistors; Stock 1: 47928; Pricing 1: 1=0.1, 10=0.021, 50=0.0116, 100=0.0088, 250=0.00652, 500=0.0048, 1000=0.0032, 2500=0.0027 (USD); Packaging: Cut Tape (CT); Resistance (Ohms): 1.2k; Composition: Thick Film; Features: -; Operating Temperature: -55°C ~ 155°C; Package / Case: 0805 (2012 Metric); Supplier Device Package: 0805; Size / Dimension: 0.079" L x 0.049" W (2.00mm x 1.25mm); Height: 0.026" (0.65mm); Number of Terminations: 2; ComponentLink3URL: http://www.seielect.com/Catalog/SEI-RMCF_RMCP.pdf; ComponentLink3Description: http://www.seielect.com/Catalog/SEI-RMCF_RMCP.pdf; Supplier Part Number 1: RMCF0805JT1K20CT-ND
R17 R18 = 4.7K,0805: BOURNS - CR0805-FX-4701GLF - RESISTOR, 4.7K, 0.125W, 1%; Product Range: BOURNS - CR Series; Resistance: 4.7; Power Rating: 125; Resistor Case Style: 0805 [2012 Metric]; Resistor Element Material: Thick Film; Temperature Coefficient: ± 100; Voltage Rating: 150; SVHC: No SVHC (16-Jun-2014); Resistor Mounting: SMD<!--FANDB--><div class="features-and-benefits-container"></div>; Tolerance: ±5%; Power (Watts): 0.125W, 1/8W; Supplier 1: Digi-Key; Manufacturer: BOURNS; Manufacturer Part Number: CR0805-FX-4701GLF; RoHS: YES; Stock 1: 1014866; Pricing 1: 1=0.1, 50=0.0196, 100=0.0149, 250=0.01104, 500=0.00816, 1000=0.00544, 2500=0.00459 (USD); Resistance Tolerance: ± 1%; Packaging: Cut Tape; MSL: MSL 1 - Unlimited; ComponentLink1URL: http://www.farnell.com/datasheets/1845293.pdf; ComponentLink1Description: http://www.farnell.com/datasheets/1845293.pdf; Supplier Part Number 1: P4.7KACT-ND; Category: Resistors; Resistance (Ohms): 4.7k; Composition: Thick Film; Features: Automotive AEC-Q200; Operating Temperature: -55°C ~ 155°C; Package / Case: 0805 (2012 Metric); Supplier Device Package: 0805; Size / Dimension: 0.079" L x 0.049" W (2.00mm x 1.25mm); Height: 0.028" (0.70mm); Number of Terminations: 2; ComponentLink2URL: http://industrial.panasonic.com/www-cgi/jvcr13pz.cgi?E+PZ+3+AOA0001+ERJ6GEYJ472V+7+WW; ComponentLink2Description: http://industrial.panasonic.com/www-cgi/jvcr13pz.cgi?E+PZ+3+AOA0001+ERJ6GEYJ472V+7+WW
U2 = AM335X_15mmx15mm: as U2 on sheet AM3359_A; Cost10K: 10.00; Supplier 1: Digi-Key

## Sheet AM3359_C.SchDoc
size A2
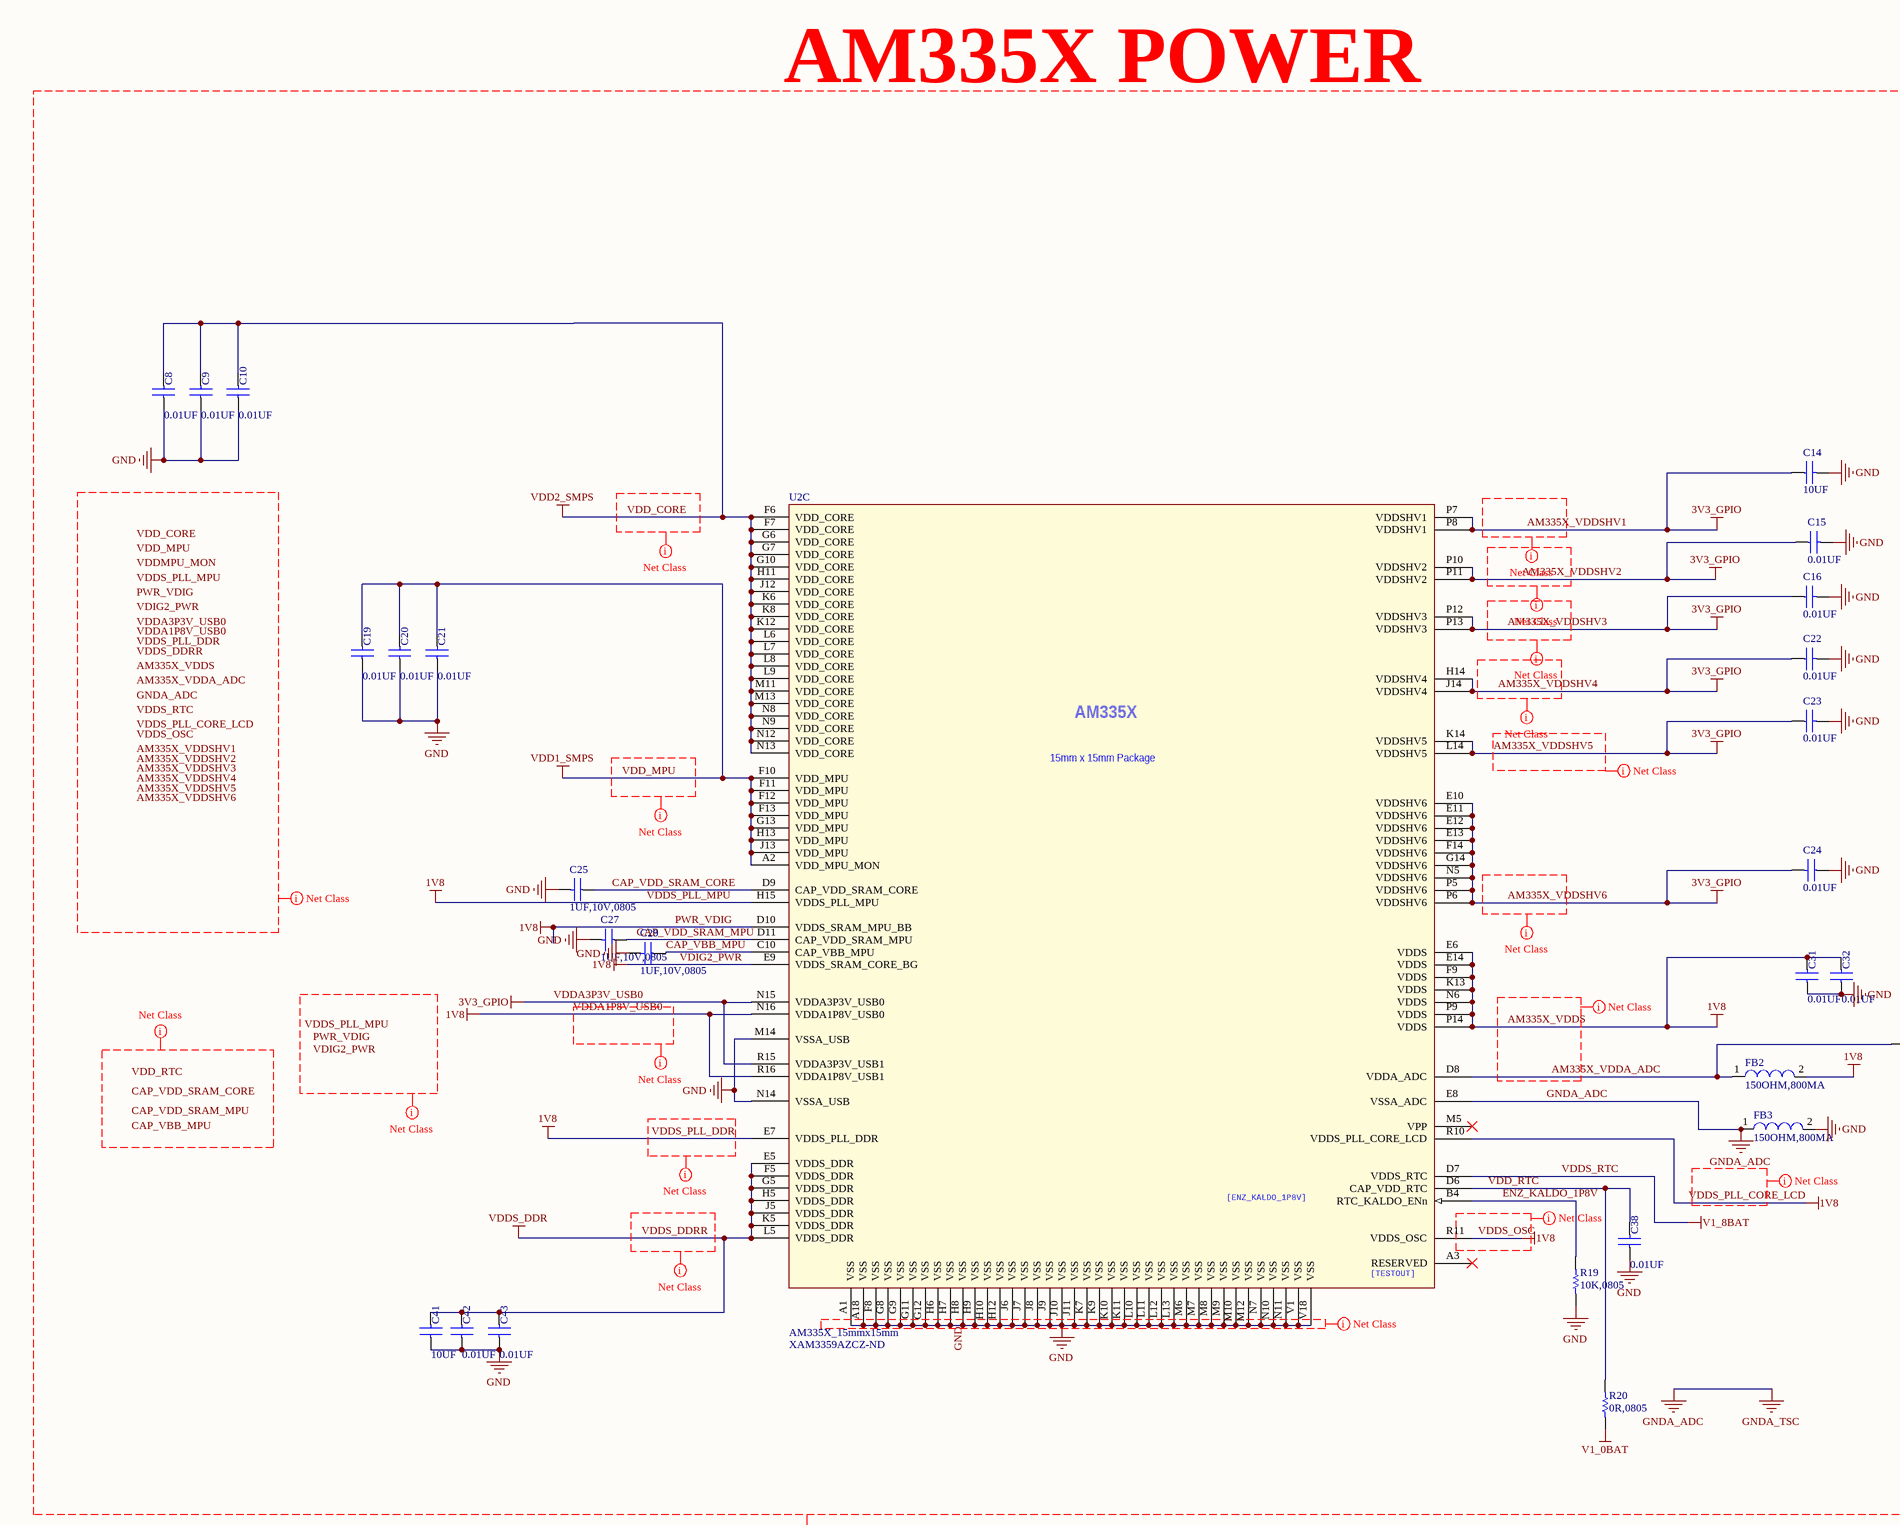
[diagram p4: AM3359_C.SchDoc, left]
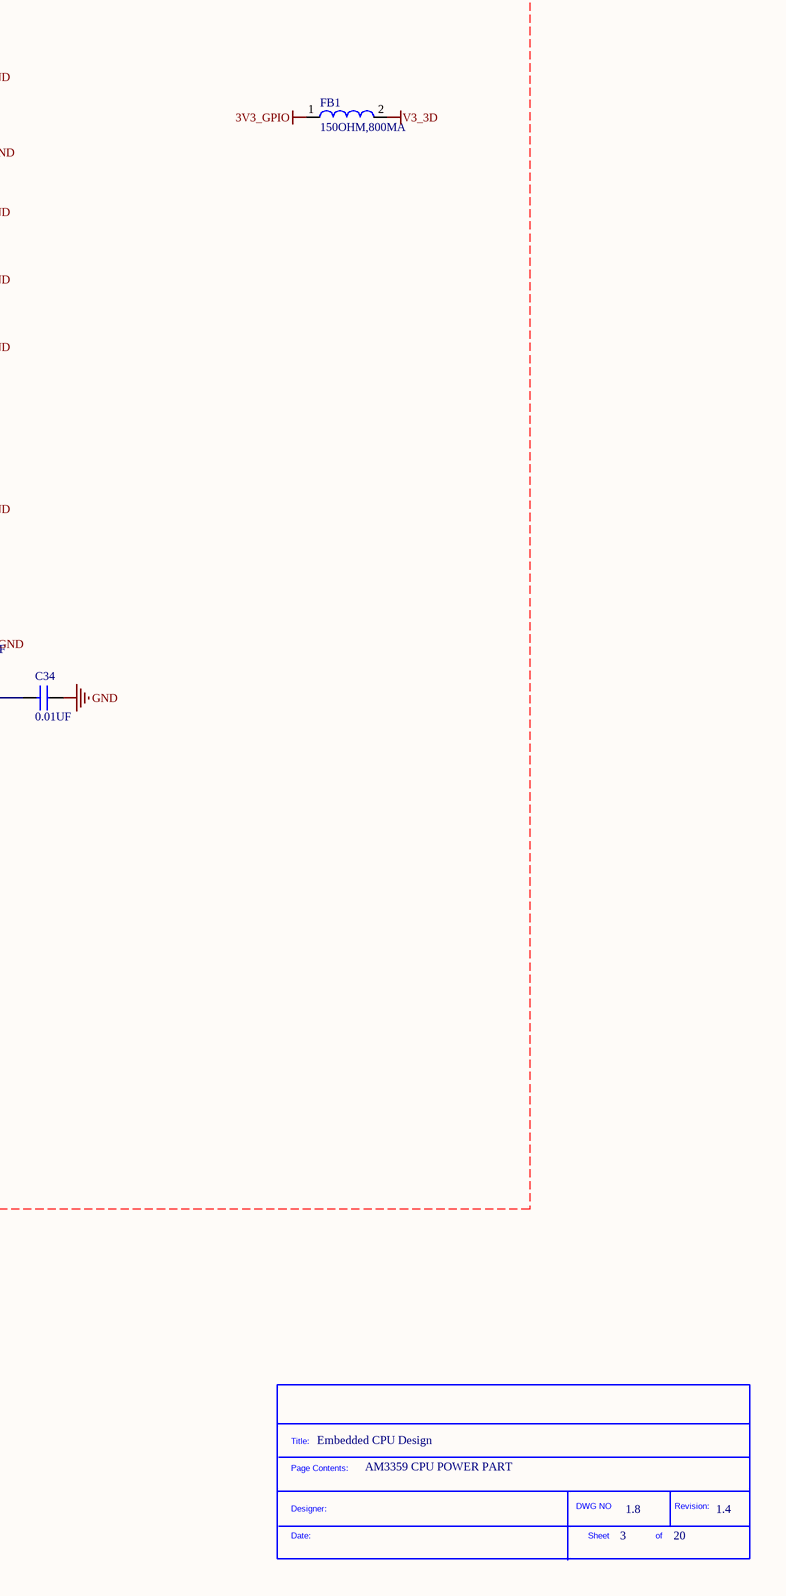
[diagram p5: AM3359_C.SchDoc, right]

### Parts
(Parts that share a designator on the sheet are numbered #1, #2 ... from top to bottom, then left to right.)
*?#3  SDTitleBlock  (value not drawn)  (graphical)
C8  0.01UF  [0402]
C9  0.01UF  [0402]
C10  0.01UF  [0402]
C14  10UF  [0402]
C15  0.01UF  [0402]
C16  0.01UF  [0402]
C19  0.01UF  [0402]
C20  0.01UF  [0402]
C21  0.01UF  [0402]
C22  0.01UF  [0402]
C23  0.01UF  [0402]
C24  0.01UF  [0402]
C25  1UF,10V,0805  [0402]
C27  1UF,10V,0805  [0402]
C29  1UF,10V,0805  [0402]
C31  0.01UF  [0402]
C32  0.01UF  [0402]
C34  0.01UF  [0402]
C38  0.01UF  [0402]
C41  10UF  [0402]
C42  0.01UF  [0402]
C43  0.01UF  [0402]
FB1  150OHM,800MA  [0805]
FB2  150OHM,800MA  [0805]
FB3  150OHM,800MA  [0805]
R19  10K,0805  [0402]
R20  0R,0805  [0402]
U2  AM335X_15mmx15mm  Supplier Part Number 1: XAM3359AZCZ-ND  [am33xx_15x15]  (part C of 3)

### Nets
1V8: C31.2 C32.2 FB2.2 U2.D10(VDDS_SRAM_MPU_BB) U2.E6(VDDS) U2.E7(VDDS_PLL_DDR) U2.E9(VDDS_SRAM_CORE_BG) U2.E14(VDDS) U2.F9(VDDS) U2.H15(VDDS_PLL_MPU) U2.K13(VDDS) U2.N6(VDDS) U2.N16(VDDA1P8V_USB0) U2.P9(VDDS) U2.P14(VDDS) U2.R10(VDDS_PLL_CORE_LCD) U2.R11(VDDS_OSC) U2.R16(VDDA1P8V_USB1)  [also labelled AM335X_VDDS, PWR_VDIG, VDDA1P8V_USB0, VDDS_OSC, VDDS_PLL_CORE_LCD, VDDS_PLL_DDR, VDDS_PLL_MPU, VDIG2_PWR]  [project net 1V8_DM]
AM335X_VDDSHV1: C14.1 C15.1 C16.1 C22.1 C23.1 C24.2 FB1.1 U2.E10(VDDSHV6) U2.E11(VDDSHV6) U2.E12(VDDSHV6) U2.E13(VDDSHV6) U2.F14(VDDSHV6) U2.G14(VDDSHV6) U2.H14(VDDSHV4) U2.J14(VDDSHV4) U2.K14(VDDSHV5) U2.L14(VDDSHV5) U2.N5(VDDSHV6) U2.N15(VDDA3P3V_USB0) U2.P5(VDDSHV6) U2.P6(VDDSHV6) U2.P7(VDDSHV1) U2.P8(VDDSHV1) U2.P10(VDDSHV2) U2.P11(VDDSHV2) U2.P12(VDDSHV3) U2.P13(VDDSHV3) U2.R15(VDDA3P3V_USB1)  [also labelled 3V3_GPIO, AM335X_VDDSHV2, AM335X_VDDSHV3, AM335X_VDDSHV4, AM335X_VDDSHV5, AM335X_VDDSHV6, VDDA3P3V_USB0]
GND: C8.1 C9.1 C10.1 C14.2 C15.2 C16.2 C19.1 C20.1 C21.1 C22.2 C23.2 C24.1 C25.2 C27.2 C29.2 C31.1 C32.1 C34.1 C38.1 C41.1 C42.1 C43.1 FB3.2 R19.1 U2.A1(VSS) U2.A18(VSS) U2.F8(VSS) U2.G8(VSS) U2.G9(VSS) U2.G11(VSS) U2.G12(VSS) U2.H6(VSS) U2.H7(VSS) U2.H8(VSS) U2.H9(VSS) U2.H10(VSS) U2.H12(VSS) U2.J6(VSS) U2.J7(VSS) U2.J8(VSS) U2.J9(VSS) U2.J10(VSS) U2.J11(VSS) U2.K7(VSS) U2.K9(VSS) U2.K10(VSS) U2.K11(VSS) U2.L10(VSS) U2.L11(VSS) U2.L12(VSS) U2.L13(VSS) U2.M6(VSS) U2.M7(VSS) U2.M8(VSS) U2.M9(VSS) U2.M10(VSS) U2.M12(VSS) U2.M14(VSSA_USB) U2.N7(VSS) U2.N10(VSS) U2.N11(VSS) U2.N14(VSSA_USB) U2.V1(VSS) U2.V18(VSS)
GNDA_ADC: FB3.1 U2.E8(VSSA_ADC)  [also labelled GNDA_TSC]
V1_0BAT: R20.1  [project net V_1_0BAT_X]
V1_8BAT: U2.D7(VDDS_RTC)  [also labelled VDDS_RTC]  [project net V_1_8BAT_X]
V3_3D: FB1.2  [project net 3V3_DM]
VDD1_SMPS: C19.2 C20.2 C21.2 U2.A2(VDD_MPU_MON) U2.F10(VDD_MPU) U2.F11(VDD_MPU) U2.F12(VDD_MPU) U2.F13(VDD_MPU) U2.G13(VDD_MPU) U2.H13(VDD_MPU) U2.J13(VDD_MPU)  [also labelled VDD_MPU]  [project net PM_SMPS_1]
VDD2_SMPS: C8.2 C9.2 C10.2 U2.F6(VDD_CORE) U2.F7(VDD_CORE) U2.G6(VDD_CORE) U2.G7(VDD_CORE) U2.G10(VDD_CORE) U2.H11(VDD_CORE) U2.J12(VDD_CORE) U2.K6(VDD_CORE) U2.K8(VDD_CORE) U2.K12(VDD_CORE) U2.L6(VDD_CORE) U2.L7(VDD_CORE) U2.L8(VDD_CORE) U2.L9(VDD_CORE) U2.M11(VDD_CORE) U2.M13(VDD_CORE) U2.N8(VDD_CORE) U2.N9(VDD_CORE) U2.N12(VDD_CORE) U2.N13(VDD_CORE)  [also labelled VDD_CORE]  [project net PM_SMPS_2]
VDDS_DDR: C41.2 C42.2 C43.2 U2.E5(VDDS_DDR) U2.F5(VDDS_DDR) U2.G5(VDDS_DDR) U2.H5(VDDS_DDR) U2.J5(VDDS_DDR) U2.K5(VDDS_DDR) U2.L5(VDDS_DDR)  [also labelled VDDS_DDRR]  [project net PM_VDDS_DDR]
AM335X_VDDA_ADC: C34.2 FB2.1 U2.D8(VDDA_ADC)
CAP_VBB_MPU: C29.1 U2.C10(CAP_VBB_MPU)
CAP_VDD_SRAM_CORE: C25.1 U2.D9(CAP_VDD_SRAM_CORE)
CAP_VDD_SRAM_MPU: C27.1 U2.D11(CAP_VDD_SRAM_MPU)
ENZ_KALDO_1P8V: R19.2 U2.B4(RTC_KALDO_ENn)
VDD_RTC: C38.2 R20.2 U2.D6(CAP_VDD_RTC)

Not connected (* = marked no-connect by the designer): U2 A3(RESERVED)* M5(VPP)*

### Layout directives
net class VDD1_SMPS: VDD_MPU
net class VDD2_SMPS: VDD_CORE
net class VDDS_DDR: VDDS_DDRR
net class 3V3_GPIO_AM335X: 1V8, 3V3_GPIO, AM335X_VDDA_ADC, AM335X_VDDS, AM335X_VDDSHV1, AM335X_VDDSHV2, AM335X_VDDSHV3, AM335X_VDDSHV4, AM335X_VDDSHV5, AM335X_VDDSHV6, CAP_VBB_MPU, CAP_VDD_SRAM_CORE, CAP_VDD_SRAM_MPU, ENZ_KALDO_1P8V, GND, GNDA_ADC, GNDA_TSC, PWR_VDIG, V1_0BAT, V1_8BAT, V3_3D, VDD1_SMPS, VDD2_SMPS, VDD_CORE, VDD_MPU, VDD_RTC, VDDA1P8V_USB0, VDDA3P3V_USB0, VDDMPU_MON, VDDS_DDR, VDDS_DDRR, VDDS_OSC, VDDS_PLL_CORE_LCD, VDDS_PLL_DDR, VDDS_PLL_MPU, VDDS_RTC, VDIG2_PWR
net class 1V8_GPIO_AM335X: 1V8, 3V3_GPIO, AM335X_VDDA_ADC, AM335X_VDDS, AM335X_VDDSHV1, AM335X_VDDSHV2, AM335X_VDDSHV3, AM335X_VDDSHV4, AM335X_VDDSHV5, AM335X_VDDSHV6, CAP_VBB_MPU, CAP_VDD_SRAM_CORE, CAP_VDD_SRAM_MPU, ENZ_KALDO_1P8V, GND, GNDA_ADC, GNDA_TSC, PWR_VDIG, V1_0BAT, V1_8BAT, V3_3D, VDD1_SMPS, VDD2_SMPS, VDD_CORE, VDD_MPU, VDD_RTC, VDDA1P8V_USB0, VDDA3P3V_USB0, VDDMPU_MON, VDDS_DDR, VDDS_DDRR, VDDS_OSC, VDDS_PLL_CORE_LCD, VDDS_PLL_DDR, VDDS_PLL_MPU, VDDS_RTC, VDIG2_PWR
net class AM335X_C: 1V8, 3V3_GPIO, AM335X_VDDA_ADC, AM335X_VDDS, AM335X_VDDSHV1, AM335X_VDDSHV2, AM335X_VDDSHV3, AM335X_VDDSHV4, AM335X_VDDSHV5, AM335X_VDDSHV6, CAP_VBB_MPU, CAP_VDD_SRAM_CORE, CAP_VDD_SRAM_MPU, ENZ_KALDO_1P8V, GND, GNDA_ADC, GNDA_TSC, PWR_VDIG, V1_0BAT, V1_8BAT, V3_3D, VDD1_SMPS, VDD2_SMPS, VDD_CORE, VDD_MPU, VDD_RTC, VDDA1P8V_USB0, VDDA3P3V_USB0, VDDMPU_MON, VDDS_DDR, VDDS_DDRR, VDDS_OSC, VDDS_PLL_CORE_LCD, VDDS_PLL_DDR, VDDS_PLL_MPU, VDDS_RTC, VDIG2_PWR
net class GND: GND
net class CAP: CAP_VBB_MPU, CAP_VDD_SRAM_CORE, CAP_VDD_SRAM_MPU, VDD_RTC
net class PWR: AM335X_VDDA_ADC, AM335X_VDDS, AM335X_VDDSHV1, AM335X_VDDSHV2, AM335X_VDDSHV3, AM335X_VDDSHV4, AM335X_VDDSHV5, AM335X_VDDSHV6, GNDA_ADC, PWR_VDIG, VDD_CORE, VDD_MPU, VDDA1P8V_USB0, VDDA3P3V_USB0, VDDMPU_MON, VDDS_DDRR, VDDS_OSC, VDDS_PLL_CORE_LCD, VDDS_PLL_DDR, VDDS_PLL_MPU, VDDS_RTC, VDIG2_PWR

### Notes on the sheet
- AM335X POWER
- Embedded CPU Design
- AM3359 CPU POWER PART
- 3
- 1.8
- 20
- 1.4
- Labels drawn without touching a wire or pin: AM335X_VDDA_ADC, AM335X_VDDS, AM335X_VDDSHV1, AM335X_VDDSHV2, AM335X_VDDSHV3, AM335X_VDDSHV4, AM335X_VDDSHV5, AM335X_VDDSHV6, CAP_VBB_MPU, CAP_VDD_SRAM_CORE, CAP_VDD_SRAM_MPU, GNDA_ADC, PWR_VDIG, VDD_CORE, VDD_MPU, VDD_RTC, VDDA1P8V_USB0, VDDA3P3V_USB0, VDDMPU_MON, VDDS_DDRR, VDDS_OSC, VDDS_PLL_CORE_LCD, VDDS_PLL_DDR, VDDS_PLL_MPU, VDDS_RTC, VDIG2_PWR
- (in symbol AM335X_15mmx15mm, part C) AM335X; 15mm x 15mm Package; [ENZ_KALDO_1P8V]; [TESTOUT]
- (in symbol SDTitleBlock) Title:; Page Contents:; Designer:; DWG NO; Revision:; Date:; Sheet; of

### Library data of the parts
C8-C10 C15 C16 C19-C24 C31 C32 C34 C38 C42 C43 = GRM155R71C103KA01D: Multilayer Ceramic Capacitors MLCC - SMD/SMT 0402 0.01uF 16volts X7R 10%; Manufacturer: Murata Electronics; Type: General Purpose MLCC; Voltage Rating DC: 16 V; Case Height: 0.5 mm; Case Length: 1 mm; Temperature Coefficient / Code: +/- 15 %; Supplier 1: Mouser; Manufacturer Part Number: GRM155R71C103KA01D; RoHS: RoHS Compliant; Category: Multilayer Ceramic Capacitors MLCC - SMD/SMT; Stock 1: 784820; Pricing 1: 1=0.135, 10=0.009, 100=0.005, 2500=0.004, 10000=0.004, 20000=0.003 (AUD); Capacitance: 0.01 uF; Operating Temperature Range: - 55 C to + 125 C; Package / Case: 0402 (1005 metric); Packaging: Reel; Product: General Type MLCCs; Series: GRM; Termination Style: SMD/SMT; Tolerance: 10 %; Brand: Murata Electronics; Case Code - in: 0402; Case Code - mm: 1005; Case Width: 0.5 mm; Dielectric: X7R; Maximum Operating Temperature: + 125 C; Minimum Operating Temperature: - 55 C; Product Category: Low & Medium Capacitance SMD Ceramic Chip Capacitors; Standard Pack Qty: 10000; RoHS - Mouser: Y; Minimum Order Quantity: 1; Reeling: True; ComponentLink1URL: http://www.murata.com/products/catalog/pdf/c02e.pdf; ComponentLink1Description: http://www.murata.com/products/catalog/pdf/c02e.pdf; Supplier Part Number 1: 81-GRM36X103K16
C14 C41 = GRM155R60J106ME44D: Multilayer Ceramic Capacitors MLCC - SMD/SMT 10UF 6.3V 20% 0402; Manufacturer: Murata Electronics; Type: General Purpose MLCC; Case Height: 0.5 mm; Case Length: 1 mm; Dielectric: X5R; Temperature Coefficient / Code: +/- 15 %; Product Status: New at Mouser; Supplier 1: Mouser; Manufacturer Part Number: GRM155R60J106ME44D; Category: Multilayer Ceramic Capacitors MLCC - SMD/SMT; Stock 1: 560073; Pricing 1: 1=0.446, 10=0.304, 100=0.228, 500=0.224, 1000=0.216, 5000=0.208, 10000=0.157 (AUD); Capacitance: 10 uF; Operating Temperature Range: - 55 C to + 85 C; Package / Case: 0402 (1005 metric); Packaging: Reel; Product: General Type MLCCs; Series: GRM; Termination Style: SMD/SMT; Tolerance: 20 %; Voltage Rating DC: 6.3 V; Brand: Murata Electronics; Case Code - in: 0402; Case Code - mm: 1005; Case Width: 0.5 mm; Maximum Operating Temperature: + 85 C; Minimum Operating Temperature: - 55 C; Standard Pack Qty: 10000; Minimum Order Quantity: 1; Reeling: True; ComponentLink1URL: http://www.murata.com/products/catalog/pdf/c02e.pdf; ComponentLink1Description: http://www.murata.com/products/catalog/pdf/c02e.pdf; Supplier Part Number 1: 81-GRM155R60J106ME4D
C25 C27 C29 = 1UF,10V,0805: AVX - 0805ZC105JAT2A - CAP, MLCC, X7R, 1UF, 10V, 0805; Capacitance: 1; Capacitance Tolerance: ± 5%; Dielectric Characteristic: X7; Voltage Rating: 10; Ceramic Capacitor Case: 0805 [2012 Metric]; SVHC: No SVHC (16-Jun-2014); Capacitor Case Style: 0805 [2012 Metric]<!--FANDB--><div class="features-and-benefits-container"></div>; Tolerance: ±5%; Supplier 1: Digi-Key; Manufacturer: AVX; Manufacturer Part Number: 0805ZC105JAT2A; RoHS: YES; Stock 1: 13938; Pricing 1: 1=0.81, 10=0.689, 100=0.403, 250=0.338, 500=0.3055, 1000=0.2795 (USD); Product Range: -; Operating Temperature Min: -55; Operating Temperature Max: 125; Packaging: Cut Tape; MSL: MSL 1 - Unlimited; Capacitance Tolerance ±: ± 5%; ComponentLink1URL: http://www.farnell.com/datasheets/1679506.pdf; ComponentLink1Description: http://www.farnell.com/datasheets/1679506.pdf; Supplier Part Number 1: 478-6224-1-ND; Category: Capacitors; Voltage - Rated: 10V; Temperature Coefficient: X7R; Mounting Type: Surface Mount, MLCC; Operating Temperature: -55°C ~ 125°C; Applications: General Purpose; Ratings: -; Package / Case: 0805 (2012 Metric); Size / Dimension: 0.079" L x 0.049" W (2.01mm x 1.25mm); Height - Seated (Max): -; Thickness (Max): 0.055" (1.40mm); Lead Spacing: -; Features: -; Lead Style: -; ComponentLink2URL: http://www.avx.com/docs/Catalogs/cx7r.pdf; ComponentLink2Description: http://www.avx.com/docs/Catalogs/cx7r.pdf
FB1-FB3 = 150OHM,800MA: FERRITE 800MA 150 OHM 0805 SMD; Manufacturer: Laird-Signal Integrity Products; Manufacturer Part Number: LI0805H151R-10; Impedance @ Frequency: 150 Ohm @ 100MHz; DC Resistance (DCR): 150 mOhm Max; Filter Type: Differential Mode - Single; Supplier 1: Digi-Key; RoHS: RoHS Compliant; Category: Filters; Stock 1: 418596; Pricing 1: 1=0.1, 10=0.07, 25=0.064, 50=0.0574, 100=0.0421, 250=0.03064, 500=0.02808, 1000=0.02424 (USD); Packaging: Cut Tape (CT); Current Rating: 800mA; Package / Case: 0805 (2012 Metric); Mounting Type: Surface Mount; Height (Max): 0.043" (1.10mm); Size / Dimension: 0.079" L x 0.049" W (2.00mm x 1.25mm); ComponentLink1URL: http://www.lairdtech.com/WorkArea/linkit.aspx?LinkIdentifier=id&ItemID=4912; ComponentLink1Description: http://www.lairdtech.com/WorkArea/linkit.aspx?LinkIdentifier=id&ItemID=4912; Supplier Part Number 1: 240-2384-1-ND
R19 = 10K,0805: BOURNS - CR0805-FX-1002GLF - RESISTOR, 10K, 0.125W, 1%; Product Range: BOURNS - CR Series; Resistance: 10; Power Rating: 125; Resistor Case Style: 0805 [2012 Metric]; Resistor Element Material: Thick Film; Temperature Coefficient: ± 100; Voltage Rating: 150; SVHC: No SVHC (16-Jun-2014); Resistor Mounting: SMD<!--FANDB--><div class="features-and-benefits-container"></div>; Power (Watts): 0.125W, 1/8W; Supplier 1: Digi-Key; Manufacturer: BOURNS; Manufacturer Part Number: CR0805-FX-1002GLF; RoHS: YES; Stock 1: 1116166; Pricing 1: 1=0.1, 10=0.029, 50=0.0162, 100=0.0123, 250=0.00912, 500=0.00672, 1000=0.00448, 2500=0.00378 (USD); Resistance Tolerance: ± 1%; Packaging: Cut Tape; MSL: MSL 1 - Unlimited; ComponentLink1URL: http://www.farnell.com/datasheets/1845293.pdf; ComponentLink1Description: http://www.farnell.com/datasheets/1845293.pdf; Supplier Part Number 1: RMCF0805FT10K0CT-ND; Category: Resistors; Resistance (Ohms): 10k; Tolerance: ±1%; Composition: Thick Film; Features: -; Operating Temperature: -55°C ~ 155°C; Package / Case: 0805 (2012 Metric); Supplier Device Package: 0805; Size / Dimension: 0.079" L x 0.049" W (2.00mm x 1.25mm); Height: 0.026" (0.65mm); Number of Terminations: 2; ComponentLink2URL: http://www.seielect.com/Catalog/SEI-RMCF_RMCP.pdf; ComponentLink2Description: http://www.seielect.com/Catalog/SEI-RMCF_RMCP.pdf
R20 = 0R,0805: BOURNS - CR0805-J/-000ELF - RESISTOR, 0805, 0R, 5%, 1/8W; Product Range: BOURNS - CR Series; Resistance: 0; Power Rating: 125; Resistor Case Style: 0805 [2012 Metric]; Resistor Element Material: Thick Film; Temperature Coefficient: -250ppm/°C to +500; Voltage Rating: 150; SVHC: No SVHC (16-Jun-2014); Resistor Mounting: SMD<!--FANDB--><div class="features-and-benefits-container"></div>; Connector Type: RJ45; Number of Ports: 1; LED Color: Green - Yellow; Number of Cores per Jack: 6; Shielding: Shielded, EMI Finger; Tab Direction: Up; Shield Material: Brass; Resistance (Ohms): 0.0; Tolerance: Jumper; Power (Watts): 0.125W, 1/8W; Manufacturer: BOURNS; Manufacturer Part Number: CR0805-J/-000ELF; RoHS: YES; Resistance Tolerance: ± 5%; Packaging: Cut Tape; MSL: MSL 1 - Unlimited; ComponentLink1URL: http://www.farnell.com/datasheets/1845293.pdf; ComponentLink1Description: http://www.farnell.com/datasheets/1845293.pdf; Category: Connectors, Interconnects; Number of Rows: 1; Applications: 10/100 Base-T, AutoMDIX; Mounting Type: Through Hole; Orientation: 90° Angle (Right); Termination: Solder; Height Above Board: 0.555" (14.10mm); Features: Board Lock, Decoupling Capacitance; Contact Material: Phosphor Bronze; Contact Finish: Gold; Contact Finish Thickness: 50µin (1.27µm); Housing Material: Polyethylene Terephthalate (PET), Polyester; Operating Temperature: 0°C ~ 70°C; ComponentLink2URL: http://www.trpconnector.com/pdfs/6605728.pdf; ComponentLink2Description: http://www.trpconnector.com/pdfs/6605728.pdf; Supplier 1: Digi-Key; Stock 1: 1539206; Pricing 1: 1=0.1, 50=0.0196, 100=0.0149, 250=0.01104, 500=0.00816, 1000=0.00544, 2500=0.00459 (USD); Composition: Thick Film; Package / Case: 0805 (2012 Metric); Supplier Device Package: 0805; Size / Dimension: 0.079" L x 0.049" W (2.00mm x 1.25mm); Height: 0.028" (0.70mm); Number of Terminations: 2; ComponentLink3URL: http://industrial.panasonic.com/www-cgi/jvcr13pz.cgi?E+PZ+3+AOA0001+ERJ6GEY0R00V+7+WW; ComponentLink3Description: http://industrial.panasonic.com/www-cgi/jvcr13pz.cgi?E+PZ+3+AOA0001+ERJ6GEY0R00V+7+WW; Supplier Part Number 1: P0.0ACT-ND
U2 = AM335X_15mmx15mm: SubArctic Cortex A8 Processor 15x15; PartName: AM335X_15x15; Mfr: TI; MfrNum: AM335x 15x15 FBGA ZCE; TIIntPartnumber: 1A0242; Vendor: Arrow; Cost100: 10.00; Cost10K: 10.00; Supplier 1: Digi-Key

## Sheet BOOT.SchDoc
size A2
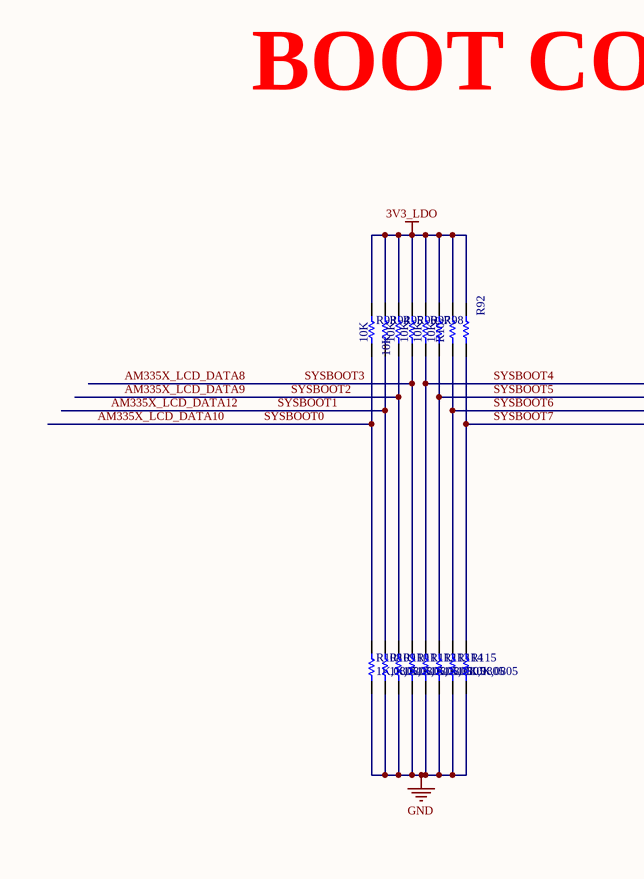
[diagram p6: BOOT.SchDoc, left]
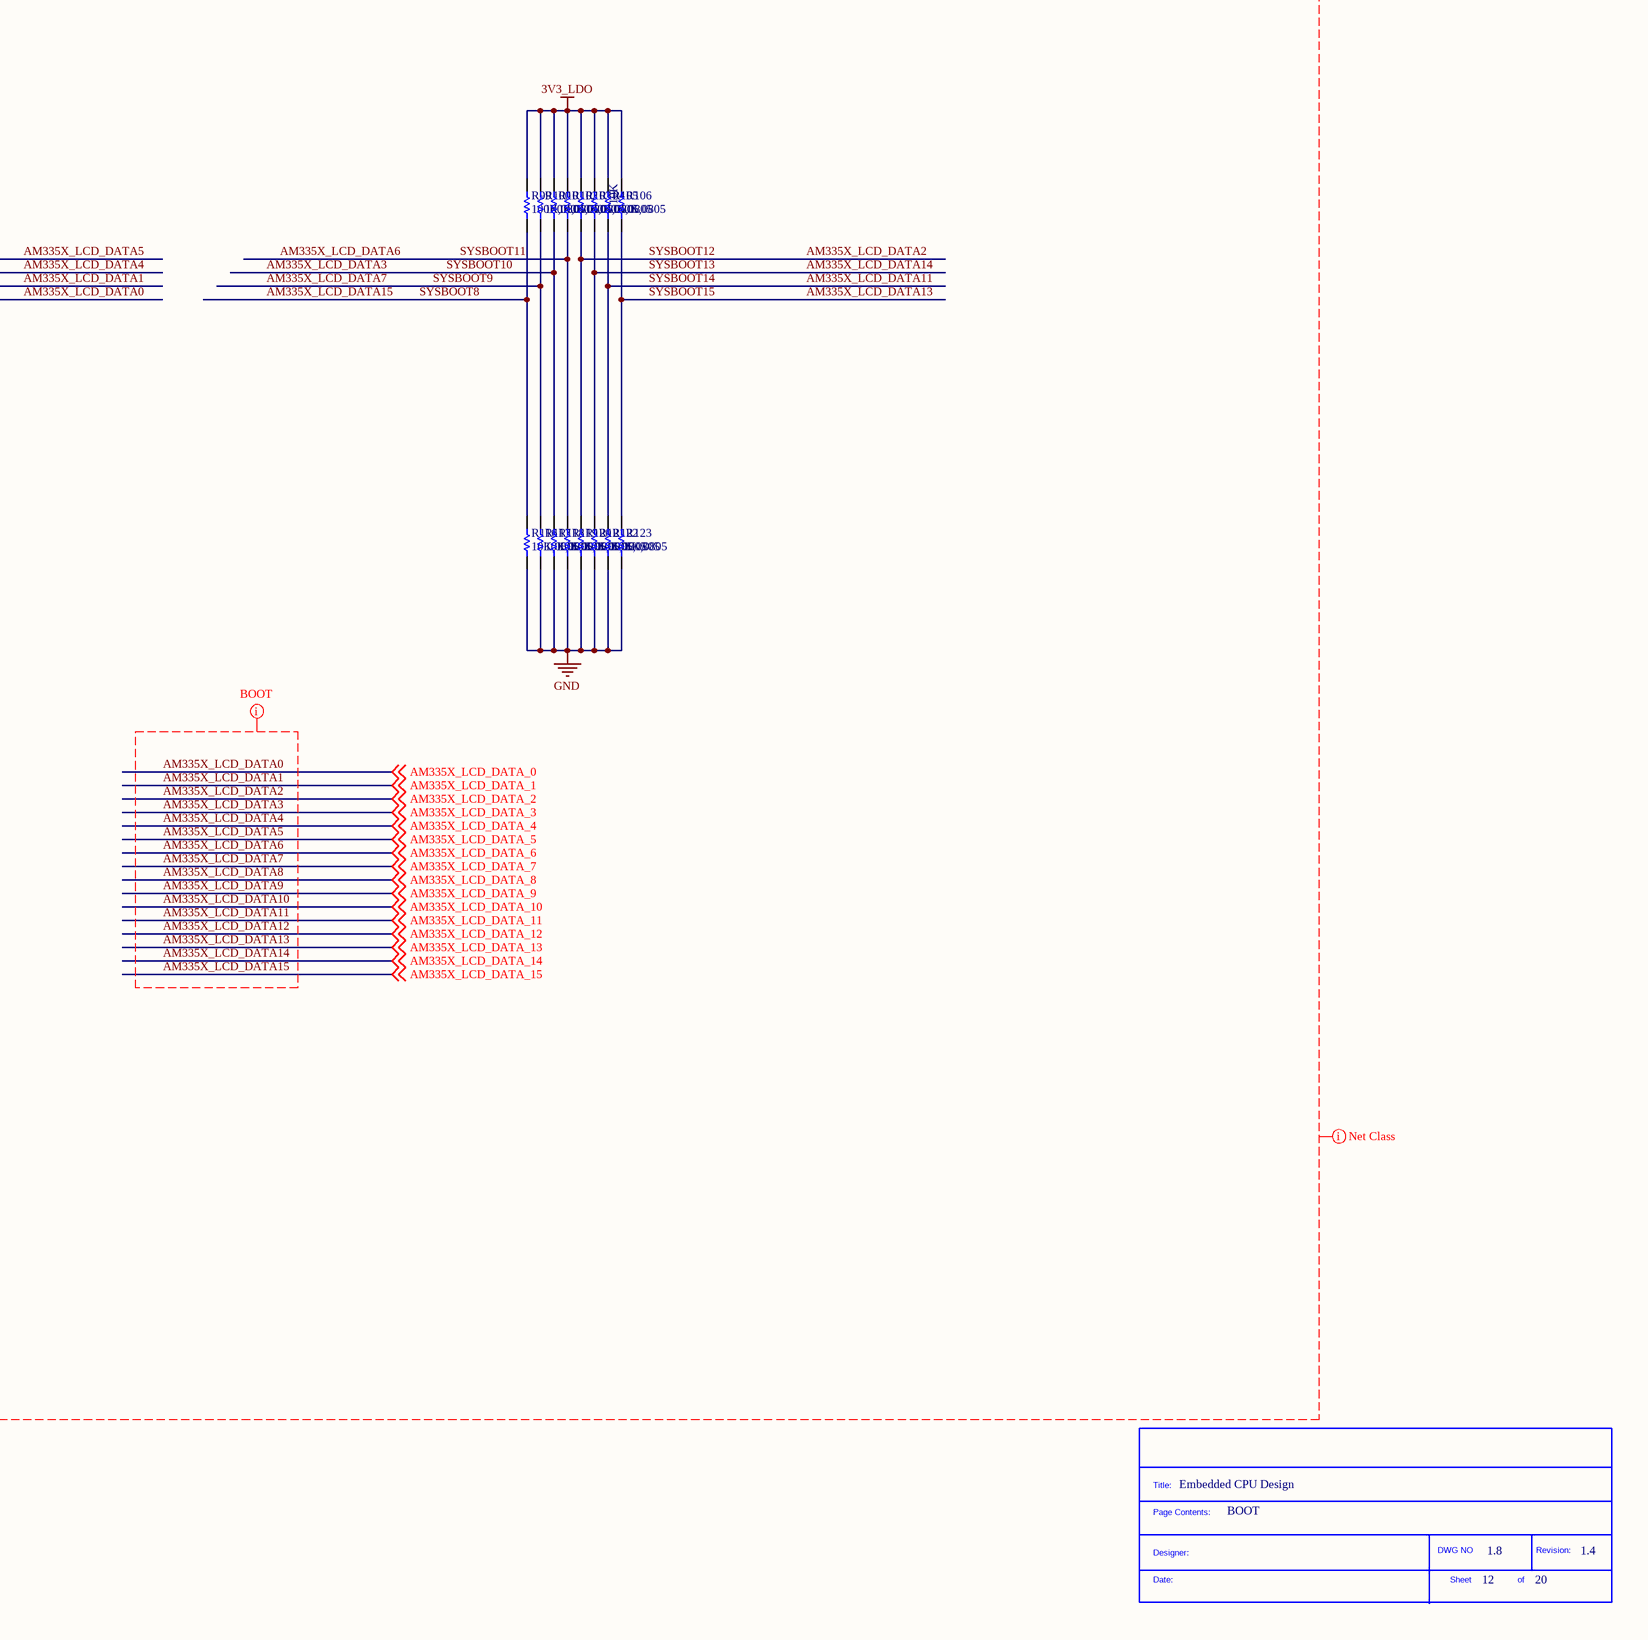
[diagram p7: BOOT.SchDoc, right]

### Parts
(Parts that share a designator on the sheet are numbered #1, #2 ... from top to bottom, then left to right.)
*?#4  SDTitleBlock  (value not drawn)  (graphical)
R92  100K,0805  [0402]  (value not drawn)
R93  10K  [0402]
R94  10K  [0402]
R95  10K  [0402]
R96  10K  [0402]
R97  10K  [0402]
R98  10K  [0402]
R99  100K,0805  [0402]
R100  100K,0805  [0402]
R101  100K,0805  [0402]
R102  100K,0805  [0402]
R103  100K,0805  [0402]
R104  100K,0805  [0402]
R105  100K,0805  [0402]
R106  10K  [0402]
R107  100K,0805  [0402]  (value not drawn)
R108  1K,0805  [0402]
R109  1K,0805  [0402]
R110  1K,0805  [0402]
R111  1K,0805  [0402]
R112  1K,0805  [0402]
R113  1K,0805  [0402]
R114  10K,0805  [0402]
R115  10K,0805  [0402]
R116  10K,0805  [0402]
R117  10K,0805  [0402]
R118  10K,0805  [0402]
R119  10K,0805  [0402]
R120  10K,0805  [0402]
R121  10K,0805  [0402]
R122  10K,0805  [0402]
R123  1K,0805  [0402]

### Nets
3V3_LDO: R92.2 R93.2 R94.2 R95.2 R96.2 R97.2 R98.2 R99.2 R100.2 R101.2 R102.2 R103.2 R104.2 R105.2 R106.2 R107.2
GND: R108.1 R109.1 R110.1 R111.1 R112.1 R113.1 R114.1 R115.1 R116.1 R117.1 R118.1 R119.1 R120.1 R121.1 R122.1 R123.1
AM335X_LCD_DATA0: R107.1 R115.2 ; off-sheet AM335X_LCD_DATA_0  [also labelled AM335X_LCD_DATA_0, SYSBOOT7]  [project net AM335X_LCD_D0]
AM335X_LCD_DATA1: R92.1 R114.2 ; off-sheet AM335X_LCD_DATA_1  [also labelled AM335X_LCD_DATA_1, SYSBOOT6]  [project net AM335X_LCD_D1]
AM335X_LCD_DATA2: R103.1 R120.2 ; off-sheet AM335X_LCD_DATA_2  [also labelled AM335X_LCD_DATA_2, SYSBOOT12]  [project net AM335X_LCD_D2]
AM335X_LCD_DATA3: R101.1 R118.2 ; off-sheet AM335X_LCD_DATA_3  [also labelled AM335X_LCD_DATA_3, SYSBOOT10]  [project net AM335X_LCD_D3]
AM335X_LCD_DATA4: R98.1 R113.2 ; off-sheet AM335X_LCD_DATA_4  [also labelled AM335X_LCD_DATA_4, SYSBOOT5]  [project net AM335X_LCD_D4]
AM335X_LCD_DATA5: R97.1 R112.2 ; off-sheet AM335X_LCD_DATA_5  [also labelled AM335X_LCD_DATA_5, SYSBOOT4]  [project net AM335X_LCD_D5]
AM335X_LCD_DATA6: R102.1 R119.2 ; off-sheet AM335X_LCD_DATA_6  [also labelled AM335X_LCD_DATA_6, SYSBOOT11]  [project net AM335X_LCD_D6]
AM335X_LCD_DATA7: R100.1 R117.2 ; off-sheet AM335X_LCD_DATA_7  [also labelled AM335X_LCD_DATA_7, SYSBOOT9]  [project net AM335X_LCD_D7]
AM335X_LCD_DATA8: R96.1 R111.2 ; off-sheet AM335X_LCD_DATA_8  [also labelled AM335X_LCD_DATA_8, SYSBOOT3]  [project net AM335X_LCD_D8]
AM335X_LCD_DATA9: R95.1 R110.2 ; off-sheet AM335X_LCD_DATA_9  [also labelled AM335X_LCD_DATA_9, SYSBOOT2]  [project net AM335X_LCD_D9]
AM335X_LCD_DATA10: R93.1 R108.2 ; off-sheet AM335X_LCD_DATA_10  [also labelled AM335X_LCD_DATA_10, SYSBOOT0]  [project net AM335X_LCD_D10]
AM335X_LCD_DATA11: R105.1 R122.2 ; off-sheet AM335X_LCD_DATA_11  [also labelled AM335X_LCD_DATA_11, SYSBOOT14]  [project net AM335X_LCD_D11]
AM335X_LCD_DATA12: R94.1 R109.2 ; off-sheet AM335X_LCD_DATA_12  [also labelled AM335X_LCD_DATA_12, SYSBOOT1]  [project net AM335X_LCD_D12]
AM335X_LCD_DATA13: R106.1 R123.2 ; off-sheet AM335X_LCD_DATA_13  [also labelled AM335X_LCD_DATA_13, SYSBOOT15]  [project net AM335X_LCD_D13]
AM335X_LCD_DATA14: R104.1 R121.2 ; off-sheet AM335X_LCD_DATA_14  [also labelled AM335X_LCD_DATA_14, SYSBOOT13]  [project net AM335X_LCD_D14]
AM335X_LCD_DATA15: R99.1 R116.2 ; off-sheet AM335X_LCD_DATA_15  [also labelled AM335X_LCD_DATA_15, SYSBOOT8]  [project net AM335X_LCD_D15]

### Layout directives
net class BOOT: AM335X_LCD_DATA0, AM335X_LCD_DATA1, AM335X_LCD_DATA2, AM335X_LCD_DATA3, AM335X_LCD_DATA4, AM335X_LCD_DATA5, AM335X_LCD_DATA6, AM335X_LCD_DATA7, AM335X_LCD_DATA8, AM335X_LCD_DATA9, AM335X_LCD_DATA10, AM335X_LCD_DATA11, AM335X_LCD_DATA12, AM335X_LCD_DATA13, AM335X_LCD_DATA14, AM335X_LCD_DATA15
net class BOOT_P: 3V3_LDO, AM335X_LCD_DATA0, AM335X_LCD_DATA1, AM335X_LCD_DATA2, AM335X_LCD_DATA3, AM335X_LCD_DATA4, AM335X_LCD_DATA5, AM335X_LCD_DATA6, AM335X_LCD_DATA7, AM335X_LCD_DATA8, AM335X_LCD_DATA9, AM335X_LCD_DATA10, AM335X_LCD_DATA11, AM335X_LCD_DATA12, AM335X_LCD_DATA13, AM335X_LCD_DATA14, AM335X_LCD_DATA15, AM335X_LCD_DATA_0, AM335X_LCD_DATA_1, AM335X_LCD_DATA_2, AM335X_LCD_DATA_3, AM335X_LCD_DATA_4, AM335X_LCD_DATA_5, AM335X_LCD_DATA_6, AM335X_LCD_DATA_7, AM335X_LCD_DATA_8, AM335X_LCD_DATA_9, AM335X_LCD_DATA_10, AM335X_LCD_DATA_11, AM335X_LCD_DATA_12, AM335X_LCD_DATA_13, AM335X_LCD_DATA_14, AM335X_LCD_DATA_15, GND, SYSBOOT0, SYSBOOT1, SYSBOOT2, SYSBOOT3, SYSBOOT4, SYSBOOT5, SYSBOOT6, SYSBOOT7, SYSBOOT8, SYSBOOT9, SYSBOOT10, SYSBOOT11, SYSBOOT12, SYSBOOT13, SYSBOOT14, SYSBOOT15

### Notes on the sheet
- BOOT CONFIGURATIONS
- Embedded CPU Design
- BOOT
- 12
- 1.8
- 20
- 1.4
- (in symbol SDTitleBlock) Title:; Page Contents:; DWG NO; Revision:; Designer:; Date:; Sheet; of

### Library data of the parts
R92 R99-R105 R107 = 100K,0805: TE CONNECTIVITY / NEOHM - CPF0805B100KE1 - RESISTOR, 0805, 100K; Product Range: TE CONNECTIVITY - CPF Series; Resistance: 100; Resistance Tolerance: ± 0.1%; Resistor Case Style: 0805 [2012 Metric]; Resistor Element Material: Thin Film; Temperature Coefficient: ± 25; Voltage Rating: 200; External Depth: 0.5; External Length / Height: 2; External Width: 1.25; Resistor Mounting: SMD; Tolerance: ±5%; Power (Watts): 0.125W, 1/8W; Supplier 1: Digi-Key; Manufacturer: TE CONNECTIVITY / NEOHM; Manufacturer Part Number: CPF0805B100KE1; RoHS: YES; Stock 1: 923150; Pricing 1: 1=0.1, 50=0.0196, 100=0.0149, 250=0.01104, 500=0.00816, 1000=0.00544, 2500=0.00459 (USD); Power Rating: 100; Packaging: Cut Tape; MSL: -; No. of Pins: 2; Operating Temperature Max: 155; Operating Temperature Min: -55; Operating Temperature Range: -55°C to +155; Series: CPF<!--FANDB--><div class="features-and-benefits-container"></div>; ComponentLink1URL: http://www.tycoelectronics.com/commerce/DocumentDelivery/DDEController?Action=srchrtrv&DocNm=1614883&DocType=Customer+Drawing&DocLang=English; ComponentLink1Description: http://www.tycoelectronics.com/commerce/DocumentDelivery/DDEController?Action=srchrtrv&DocNm=1614883&DocType=Customer+Drawing&DocLang=English; ComponentLink2URL: http://www.tycoelectronics.com/commerce/DocumentDelivery/DDEController?Action=srchrtrv&DocNm=1773200&DocType=Data+Sheet&DocLang=English; ComponentLink2Description: http://www.tycoelectronics.com/commerce/DocumentDelivery/DDEController?Action=srchrtrv&DocNm=1773200&DocType=Data+Sheet&DocLang=English; Supplier Part Number 1: P100KACT-ND; Category: Resistors; Resistance (Ohms): 100k; Composition: Thick Film; Features: Automotive AEC-Q200; Operating Temperature: -55°C ~ 155°C; Package / Case: 0805 (2012 Metric); Supplier Device Package: 0805; Size / Dimension: 0.079" L x 0.049" W (2.00mm x 1.25mm); Height: 0.028" (0.70mm); Number of Terminations: 2; ComponentLink3URL: http://industrial.panasonic.com/www-cgi/jvcr13pz.cgi?E+PZ+3+AOA0001+ERJ6GEYJ104V+7+WW; ComponentLink3Description: http://industrial.panasonic.com/www-cgi/jvcr13pz.cgi?E+PZ+3+AOA0001+ERJ6GEYJ104V+7+WW
R93-R98 R106 R114-R122 = 10K,0805: as R19 on sheet AM3359_C; Manufacturer: BOURNS; Manufacturer Part Number: CR0805-FX-1002GLF; RoHS: YES; Resistance Tolerance: ± 1%; Packaging: Cut Tape; MSL: MSL 1 - Unlimited; ComponentLink1URL: http://www.farnell.com/datasheets/1845293.pdf; ComponentLink1Description: http://www.farnell.com/datasheets/1845293.pdf; Supplier 1: Digi-Key; Category: Resistors; Stock 1: 1116166; Pricing 1: 1=0.1, 10=0.029, 50=0.0162, 100=0.0123, 250=0.00912, 500=0.00672, 1000=0.00448, 2500=0.00378 (USD); Resistance (Ohms): 10k; Tolerance: ±1%; Composition: Thick Film; Features: -; Operating Temperature: -55°C ~ 155°C; Package / Case: 0805 (2012 Metric); Supplier Device Package: 0805; Size / Dimension: 0.079" L x 0.049" W (2.00mm x 1.25mm); Height: 0.026" (0.65mm); Number of Terminations: 2; ComponentLink2URL: http://www.seielect.com/Catalog/SEI-RMCF_RMCP.pdf; ComponentLink2Description: http://www.seielect.com/Catalog/SEI-RMCF_RMCP.pdf; Supplier Part Number 1: RMCF0805FT10K0CT-ND
R108-R113 R123 = 1K,0805: BOURNS - CR0805-FX-1001ELF - RESISTOR, 1K, 0.125W, 1%; Product Range: BOURNS - CR Series; Resistance: 1; Power Rating: 125; Resistor Case Style: 0805 [2012 Metric]; Resistor Element Material: Thick Film; Temperature Coefficient: ± 100; Voltage Rating: 150; SVHC: No SVHC (16-Jun-2014); Resistor Mounting: SMD<!--FANDB--><div class="features-and-benefits-container"></div>; Power (Watts): 0.125W, 1/8W; Supplier 1: Digi-Key; Manufacturer: BOURNS; Manufacturer Part Number: CR0805-FX-1001ELF; RoHS: YES; Stock 1: 2060902; Pricing 1: 1=0.1, 50=0.0288, 100=0.0219, 250=0.01624, 500=0.012, 1000=0.008, 2500=0.00675 (USD); Resistance Tolerance: ± 1%; Packaging: Cut Tape; MSL: MSL 1 - Unlimited; ComponentLink1URL: http://www.farnell.com/datasheets/1845293.pdf; ComponentLink1Description: http://www.farnell.com/datasheets/1845293.pdf; Supplier Part Number 1: P1.00KCCT-ND; Category: Resistors; Resistance (Ohms): 1k; Tolerance: ±1%; Composition: Thick Film; Features: Automotive AEC-Q200; Operating Temperature: -55°C ~ 155°C; Package / Case: 0805 (2012 Metric); Supplier Device Package: 0805; Size / Dimension: 0.079" L x 0.049" W (2.00mm x 1.25mm); Height: 0.028" (0.70mm); Number of Terminations: 2; ComponentLink2URL: http://industrial.panasonic.com/www-cgi/jvcr13pz.cgi?E+PZ+3+AOA0002+ERJ6ENF1001V+7+WW; ComponentLink2Description: http://industrial.panasonic.com/www-cgi/jvcr13pz.cgi?E+PZ+3+AOA0002+ERJ6ENF1001V+7+WW